# EasyEDA Pro project CoreBoard-001_2024-04-29.epro, schematic Schematic-CoreBoard-001

## Sheets
1 HLK-7688A: Create Date: 2024-04-11; Page Name: HLK-7688A; Project Name: CoreBoard-001; Schematic Name: Schematic-CoreBoard-001; Update Date: 2024-04-18; Company: 嘉立创EDA; Page Size: A4; Version: V1.0
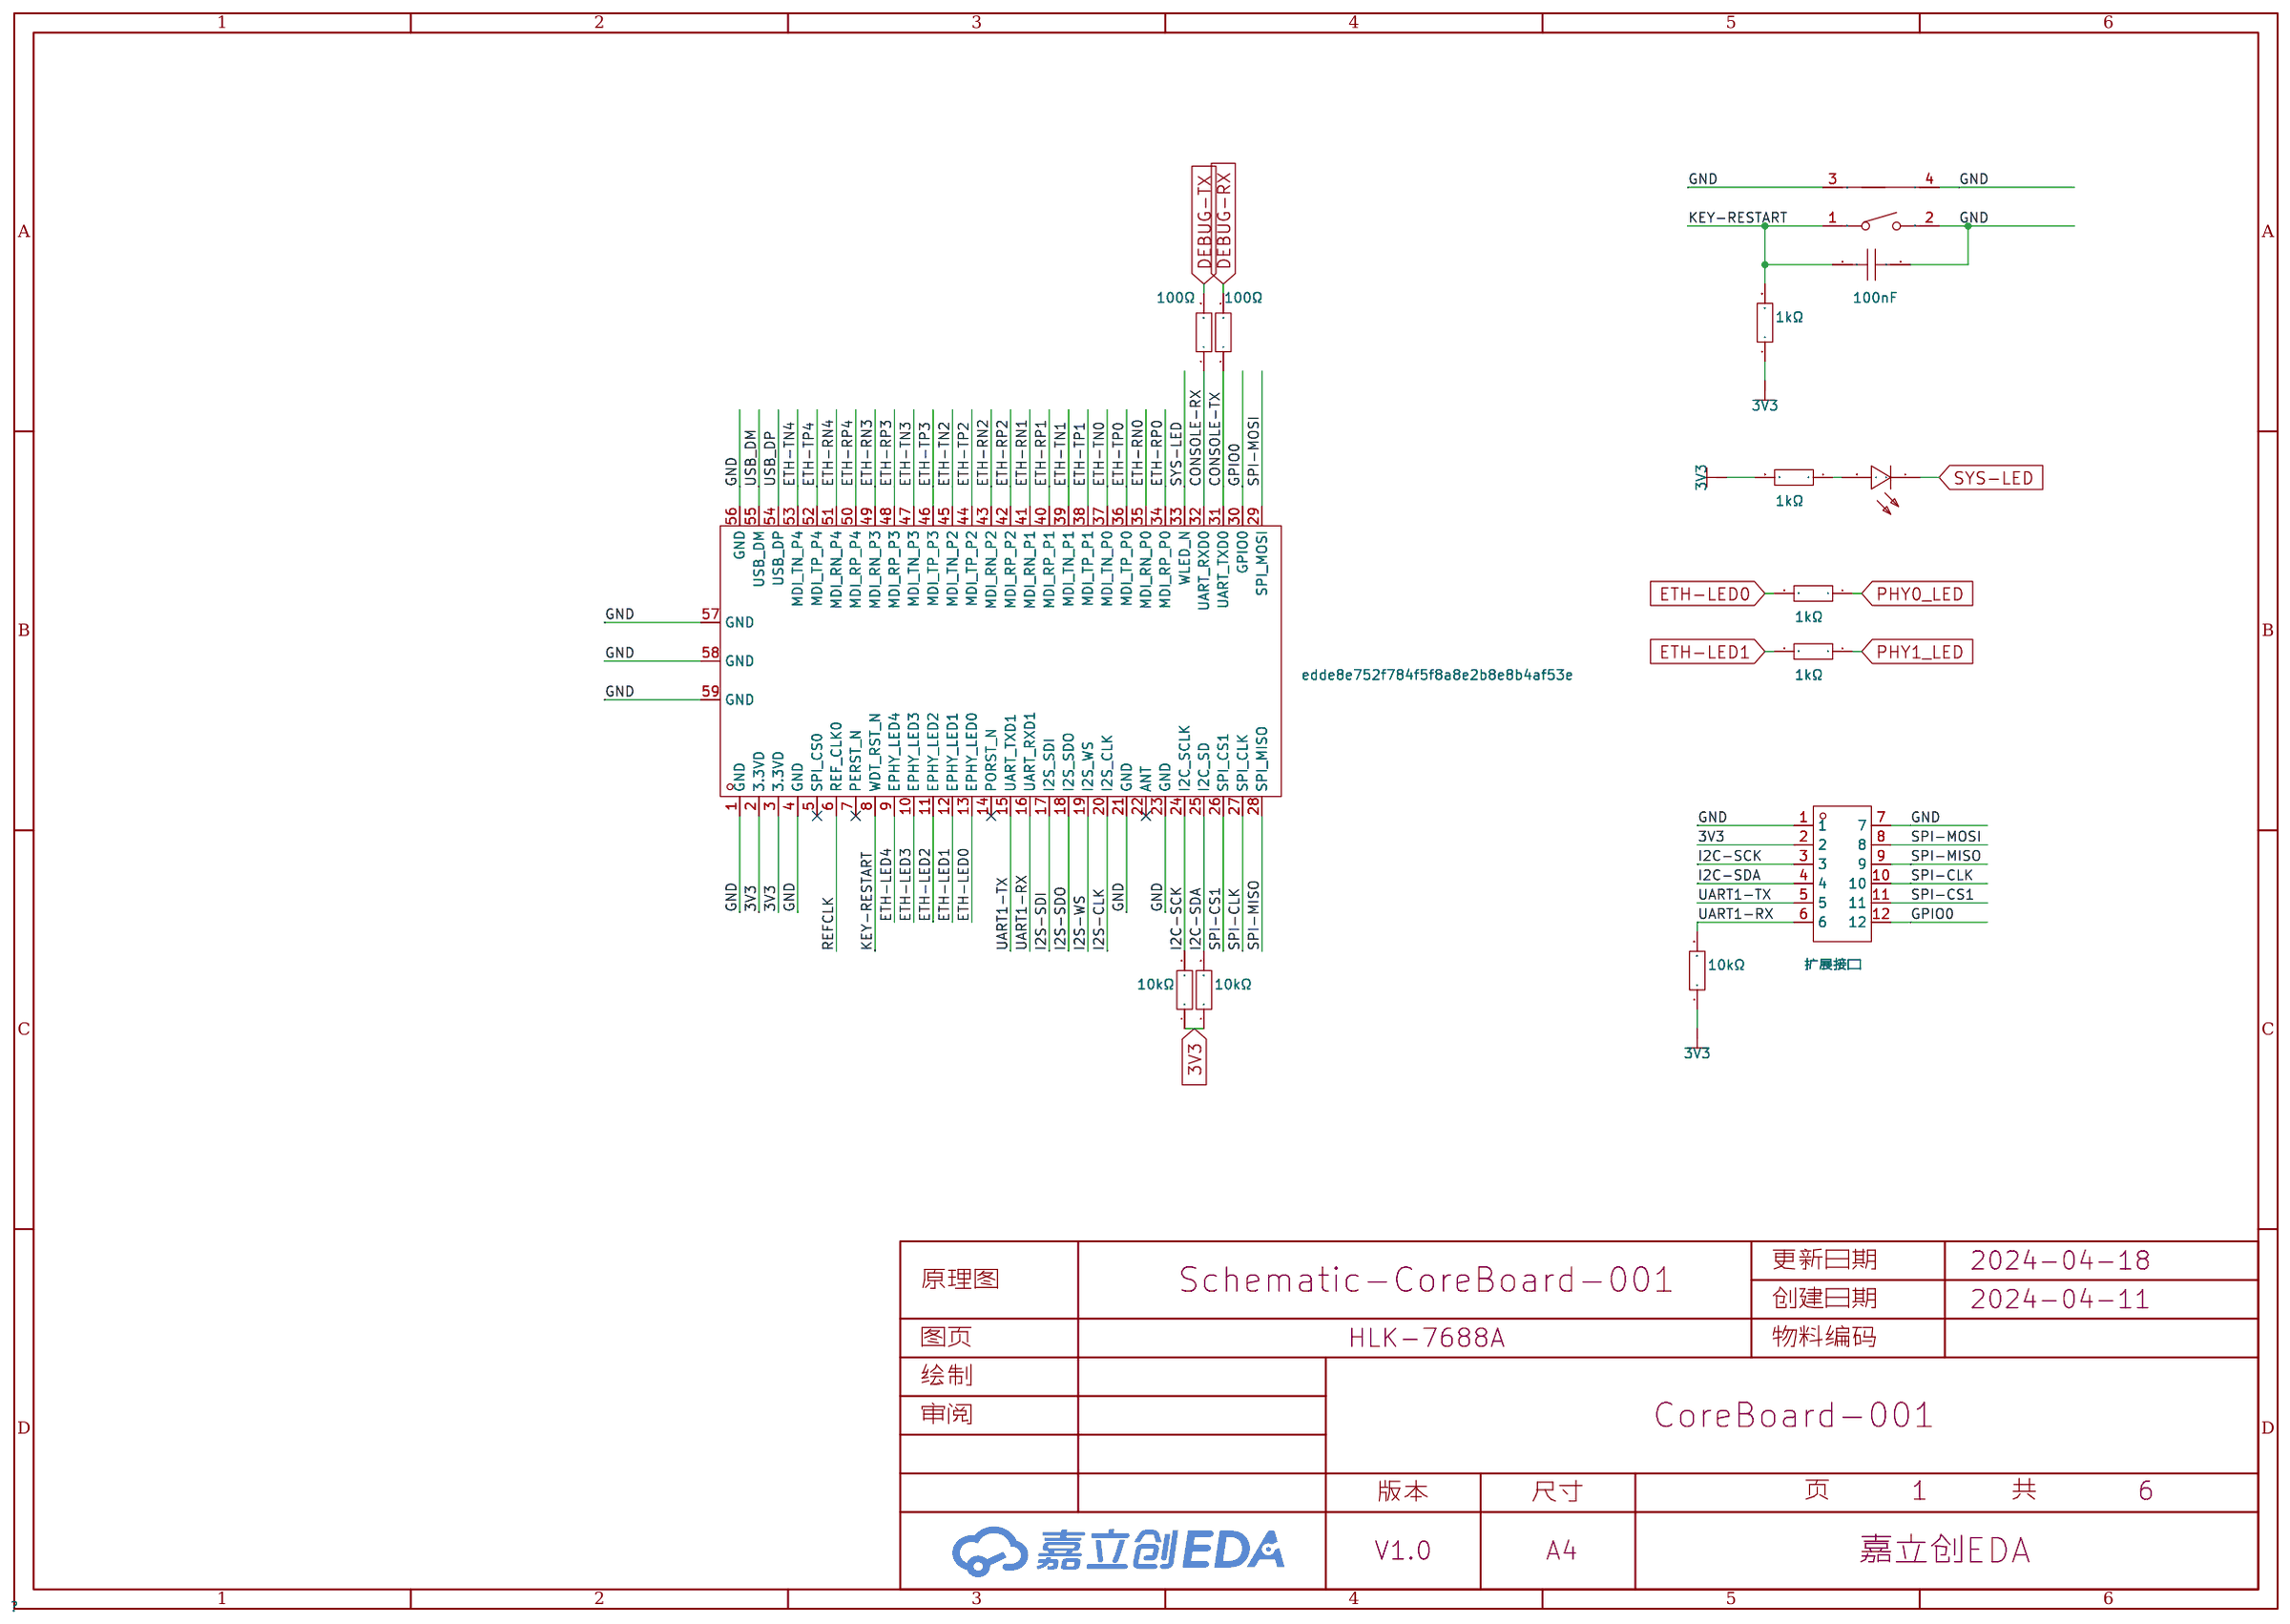
[diagram p0: HLK-7688A]
2 Power+CH340N: Page Name: Power+CH340N; Update Date: 2024-04-11
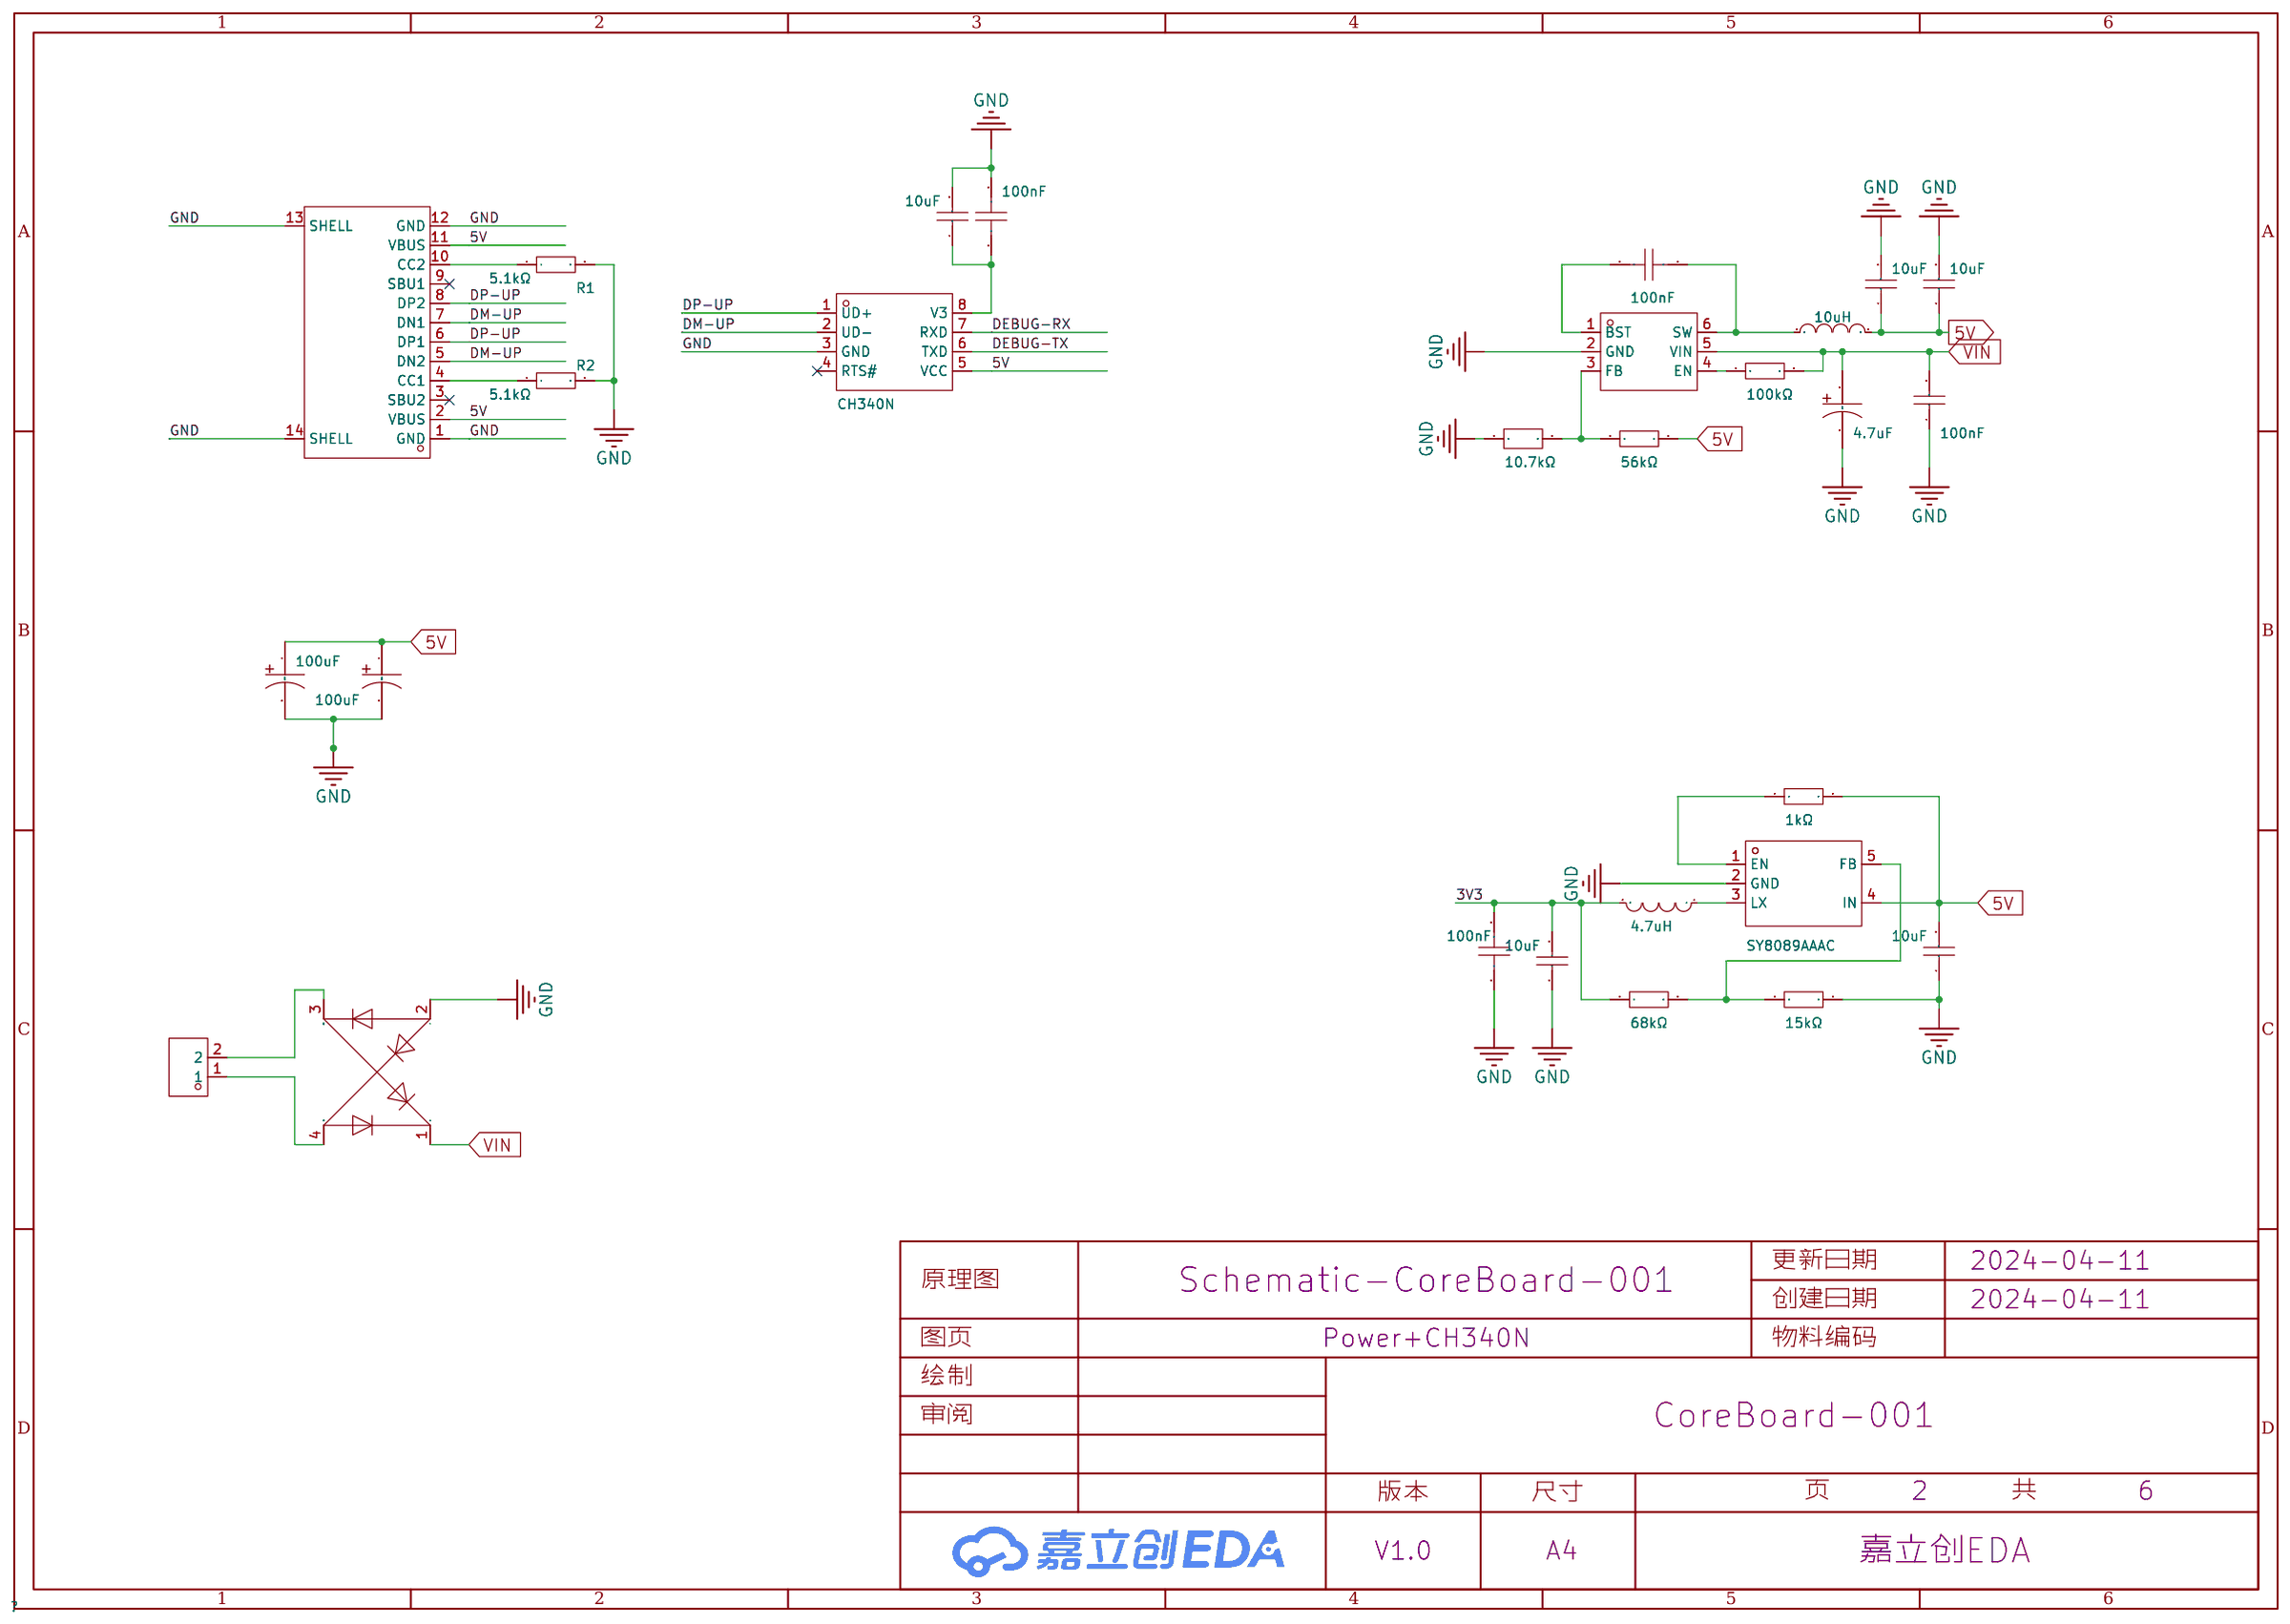
[diagram p1: Power+CH340N]
3 DS1307: Page Name: DS1307; Update Date: 2024-04-11
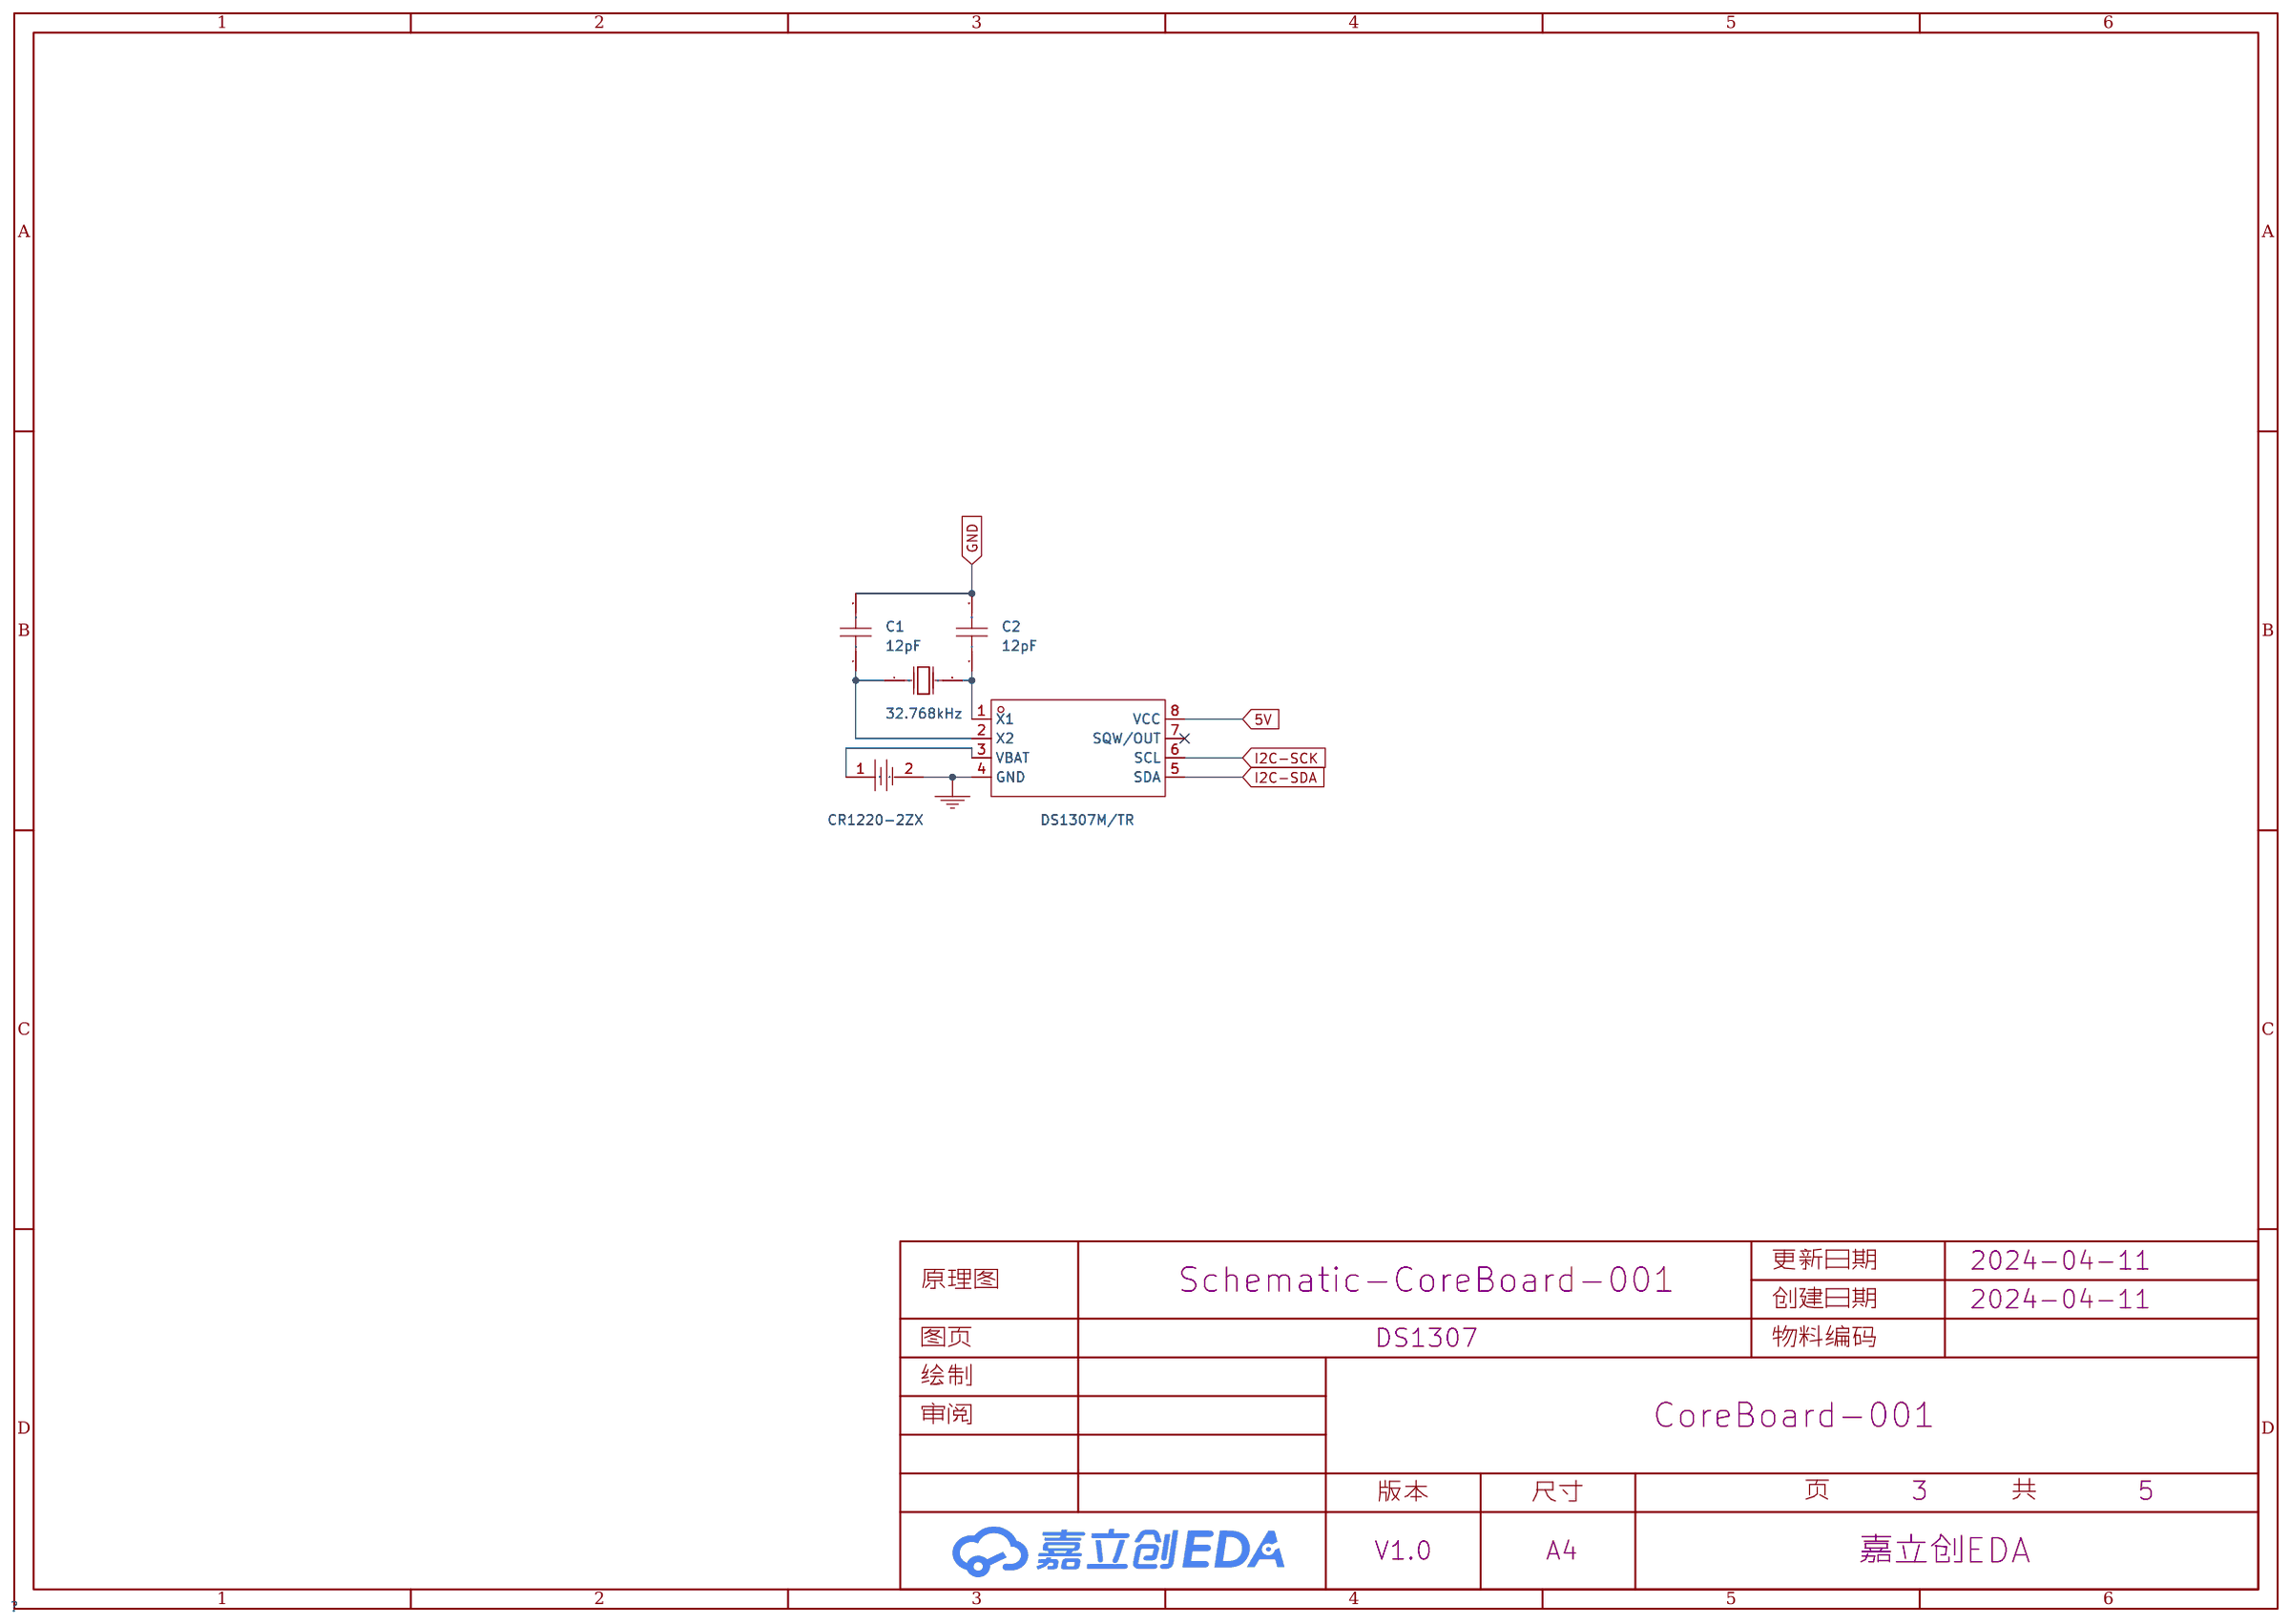
[diagram p2: DS1307]
4 USB: Page Name: USB; Update Date: 2024-04-11
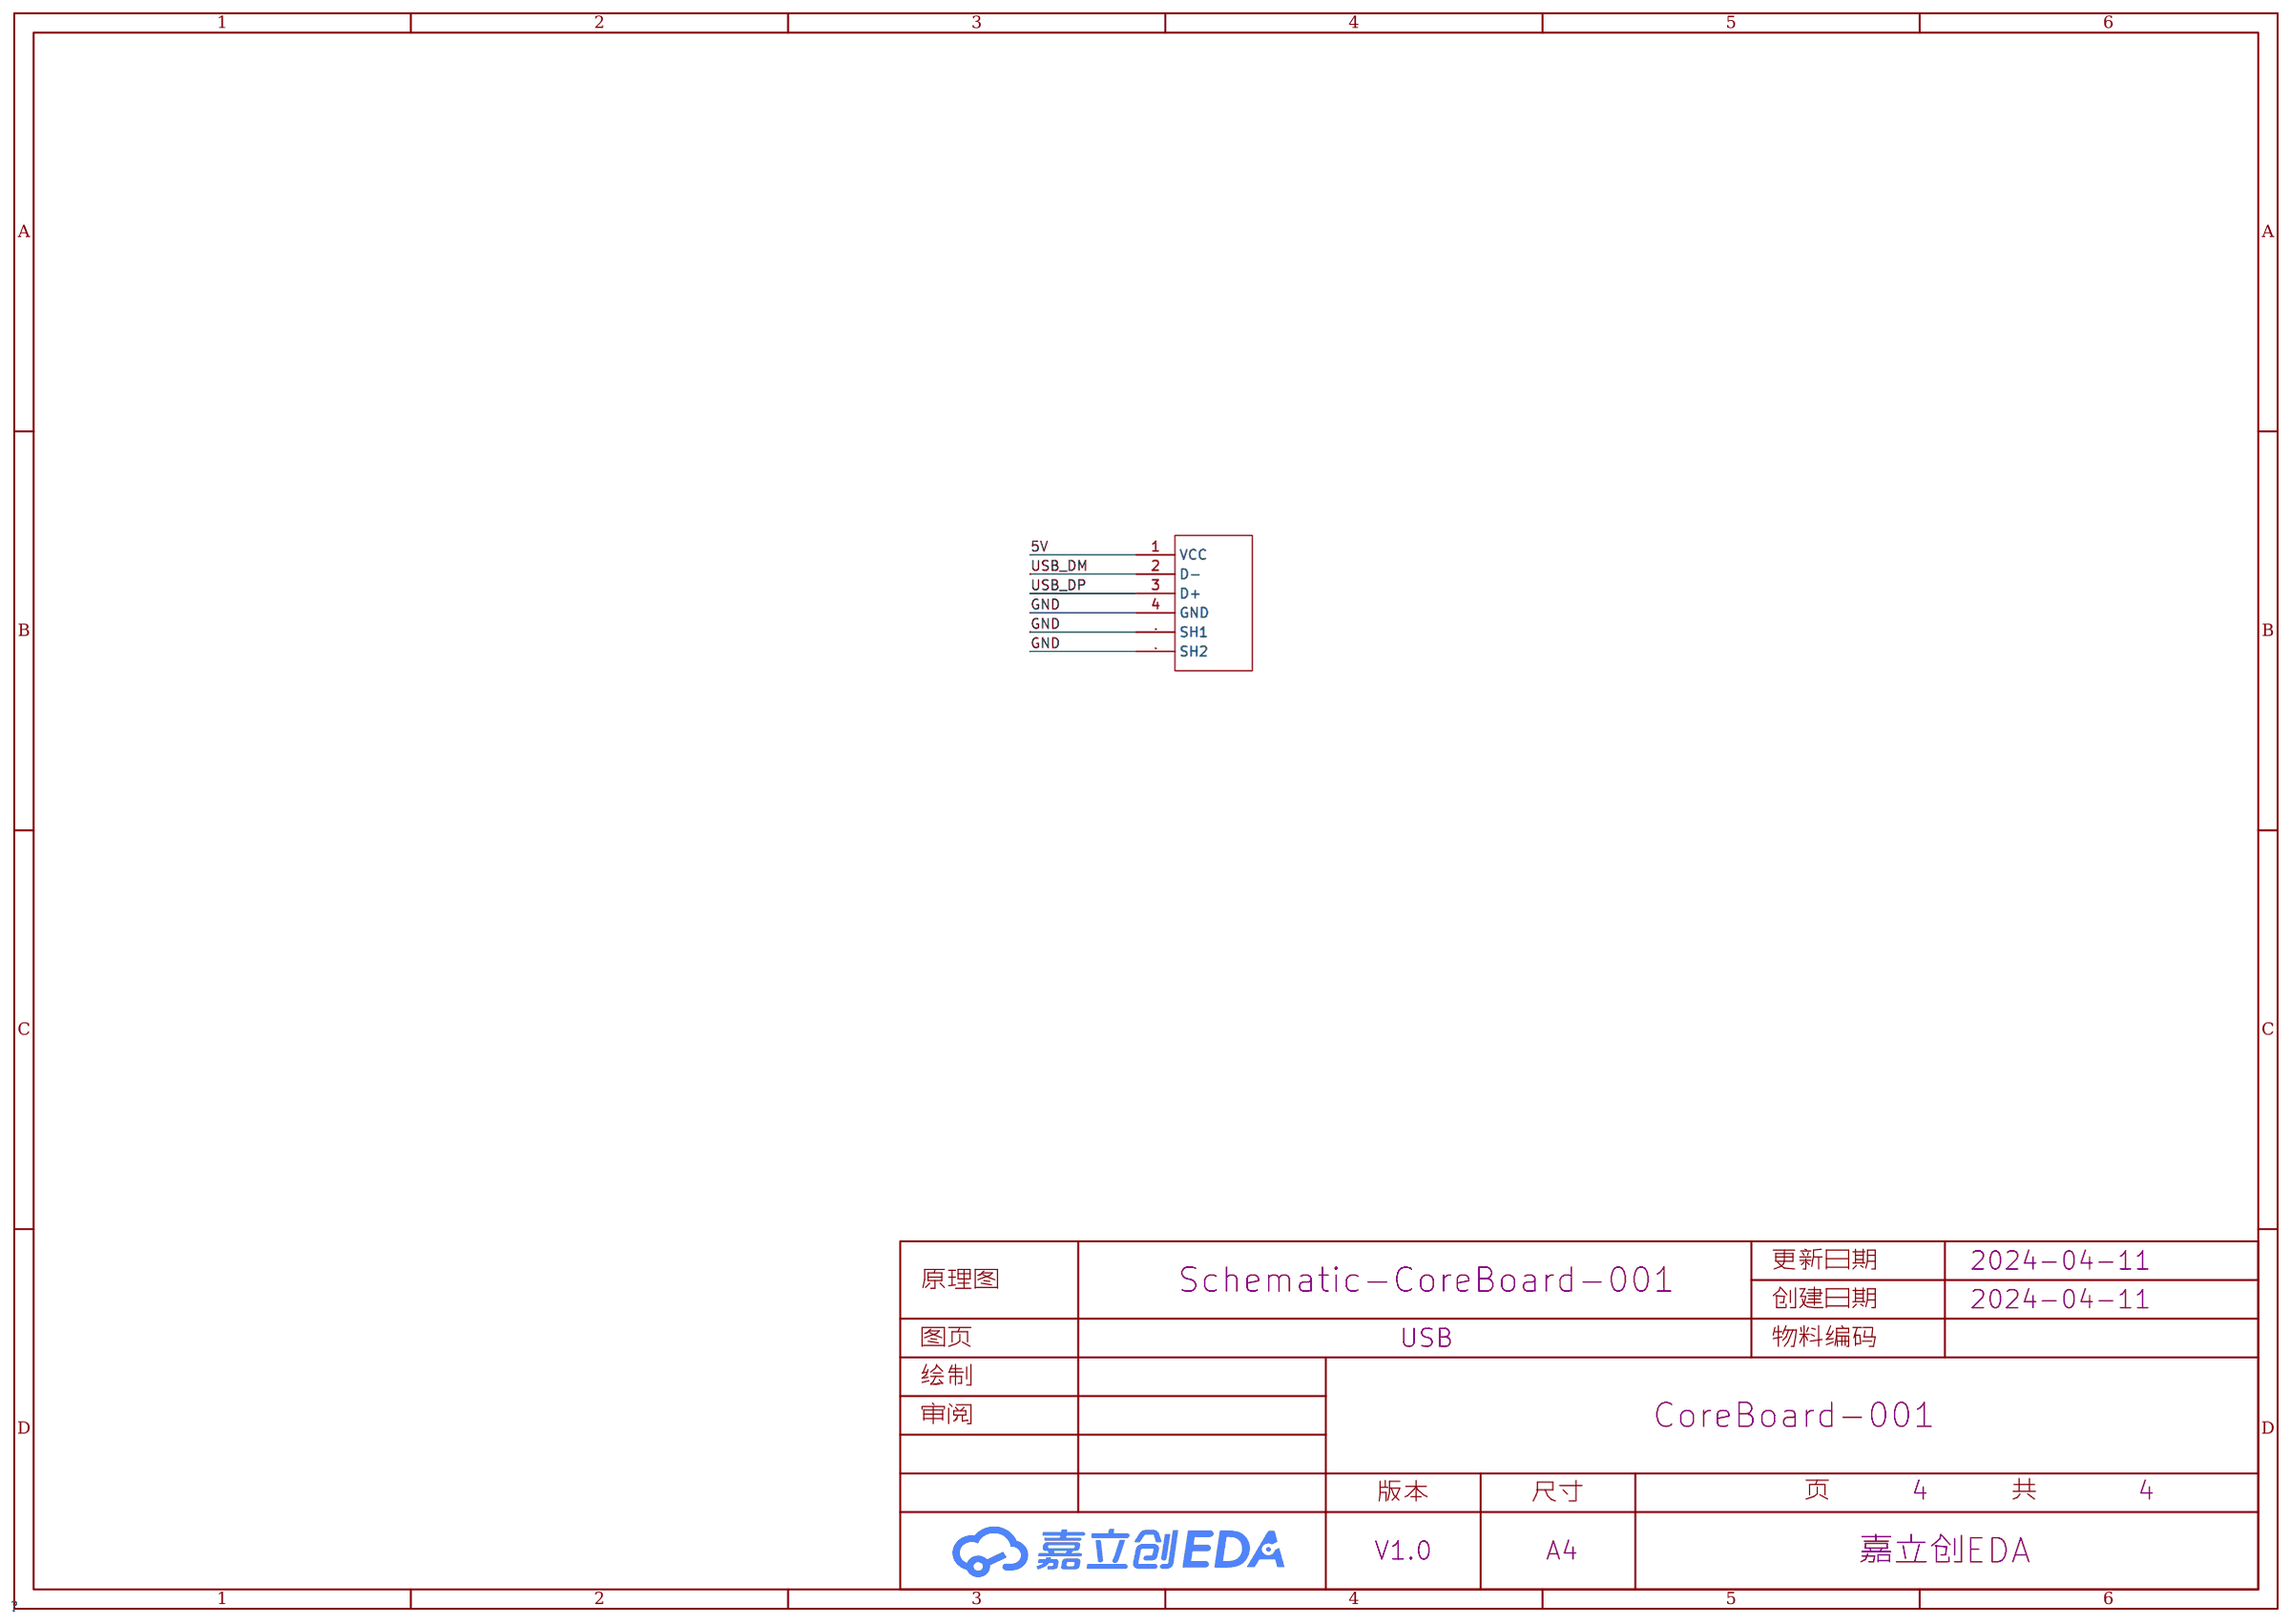
[diagram p3: USB]
5 ETH: Page Name: ETH
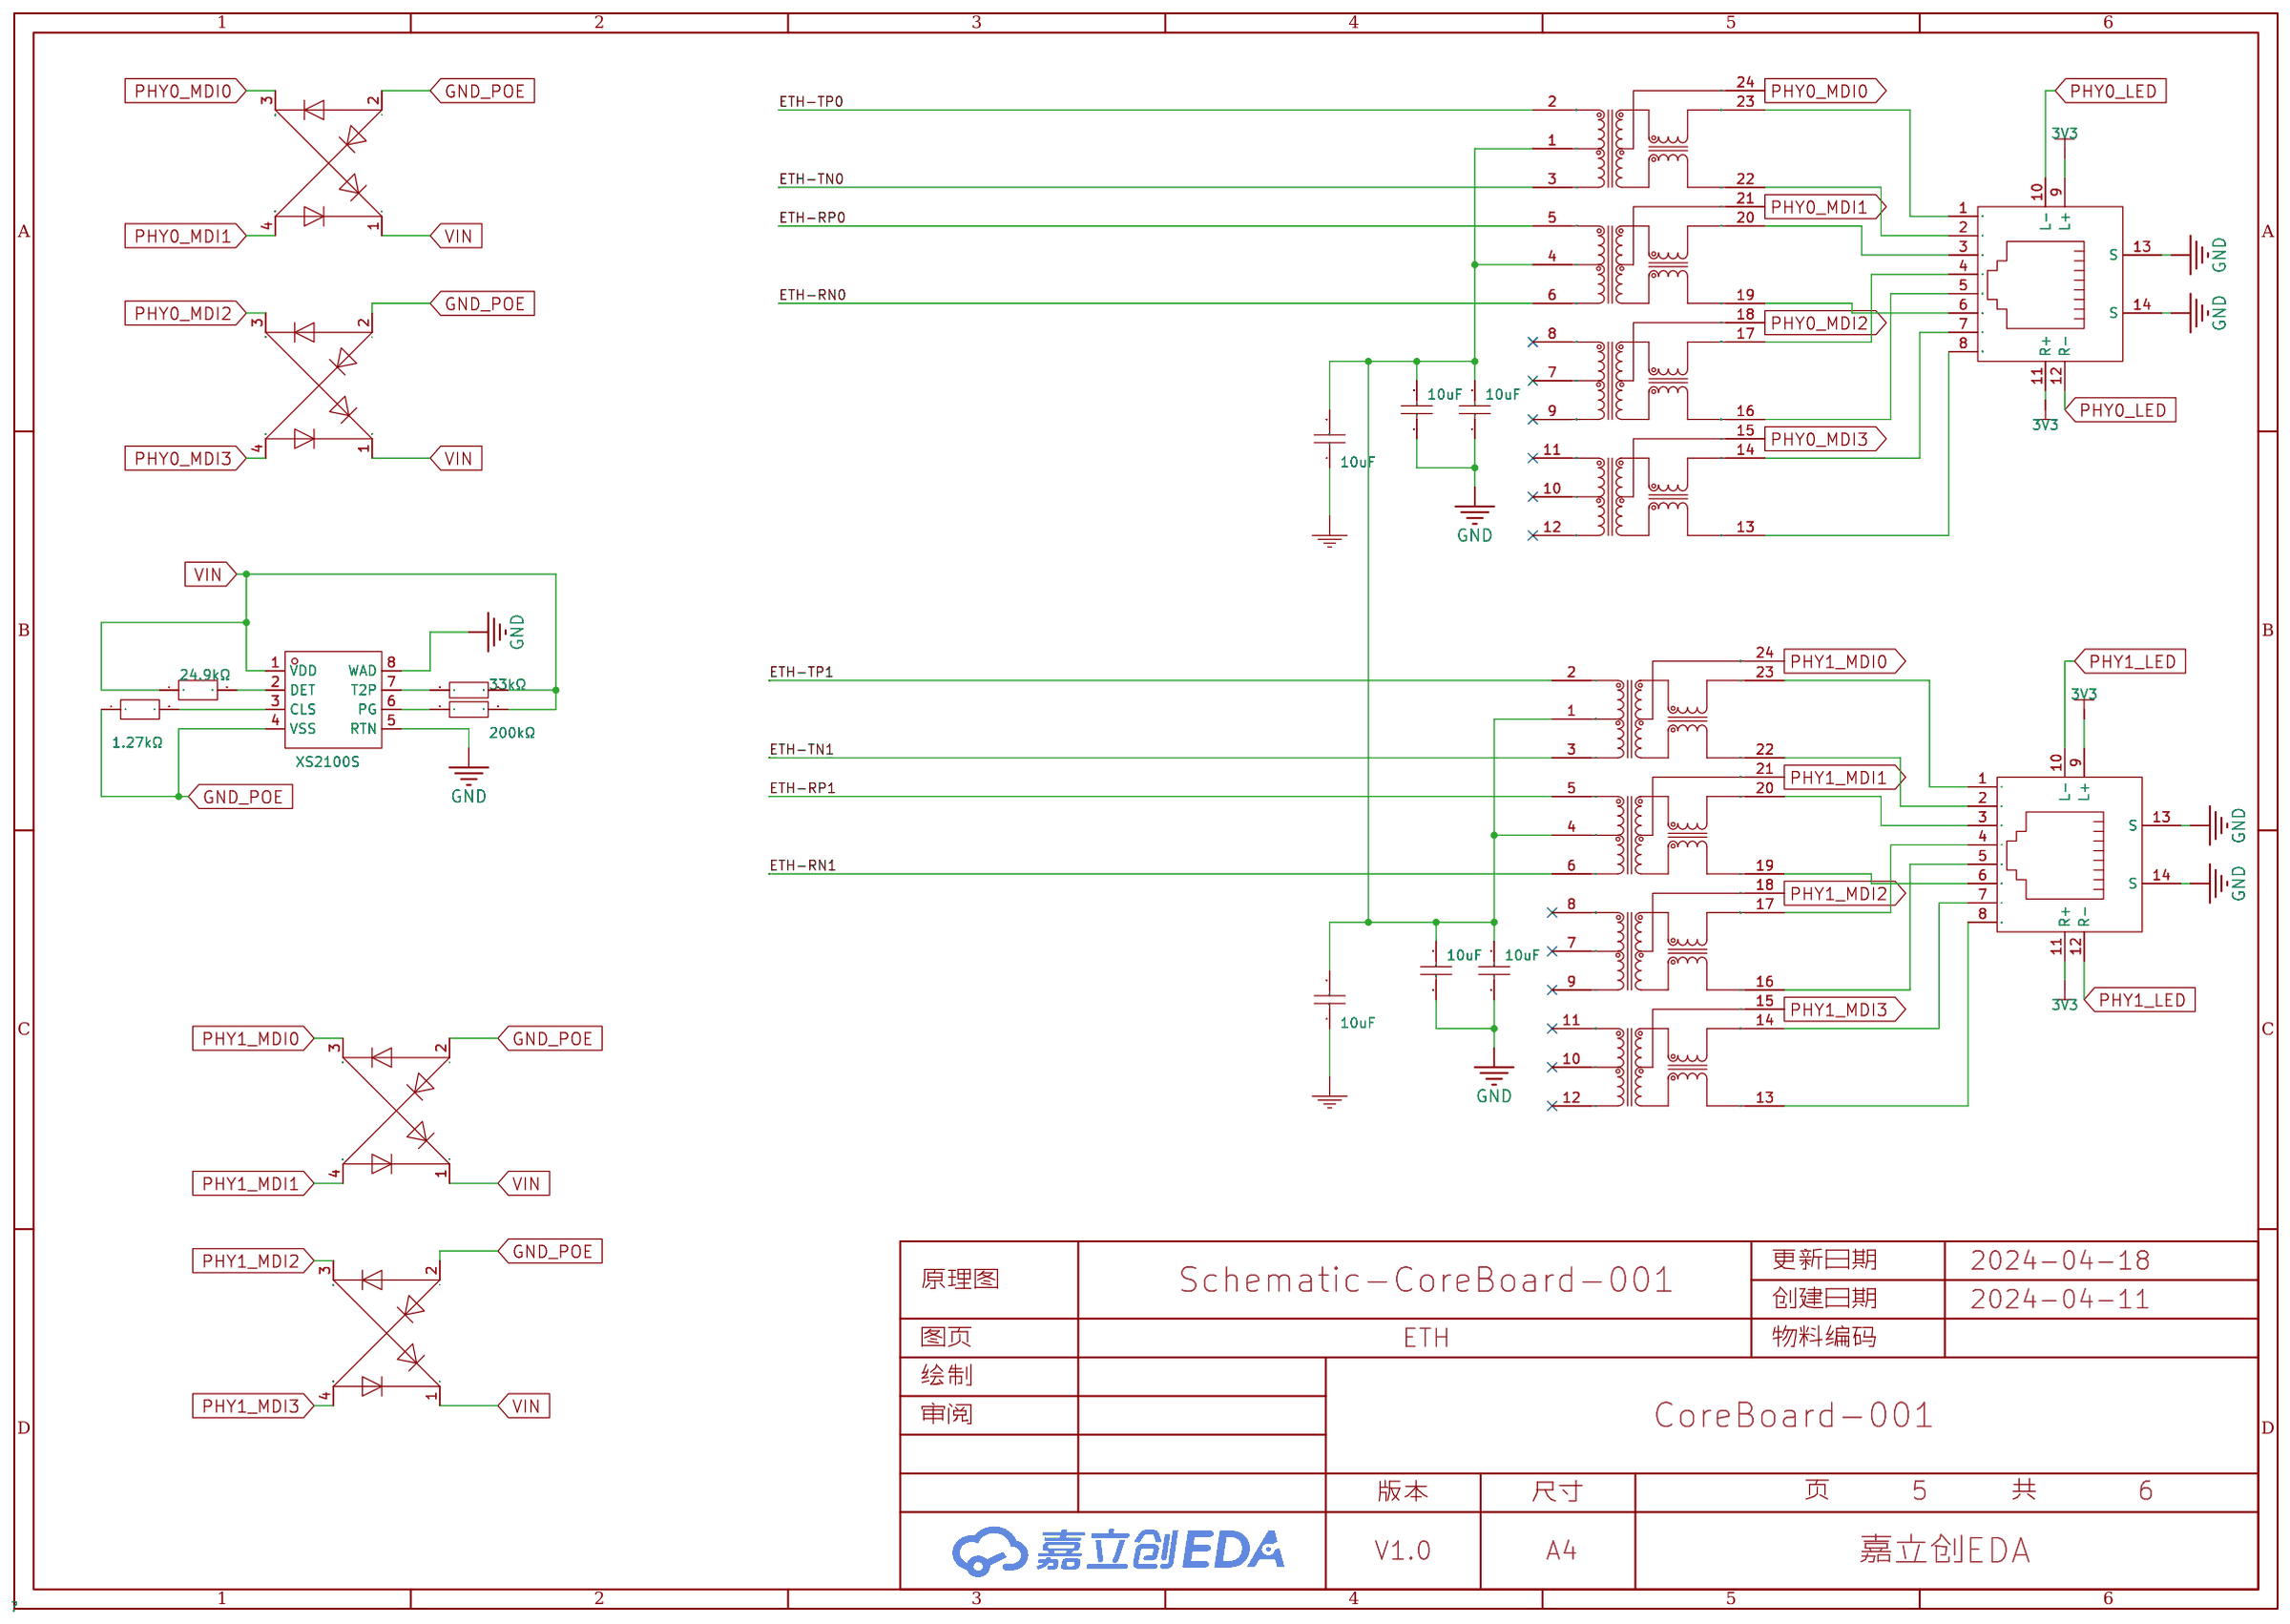
[diagram p4: ETH]
6 Audio: Create Date: 2024-04-12; Page Name: Audio; Update Date: 2024-04-19
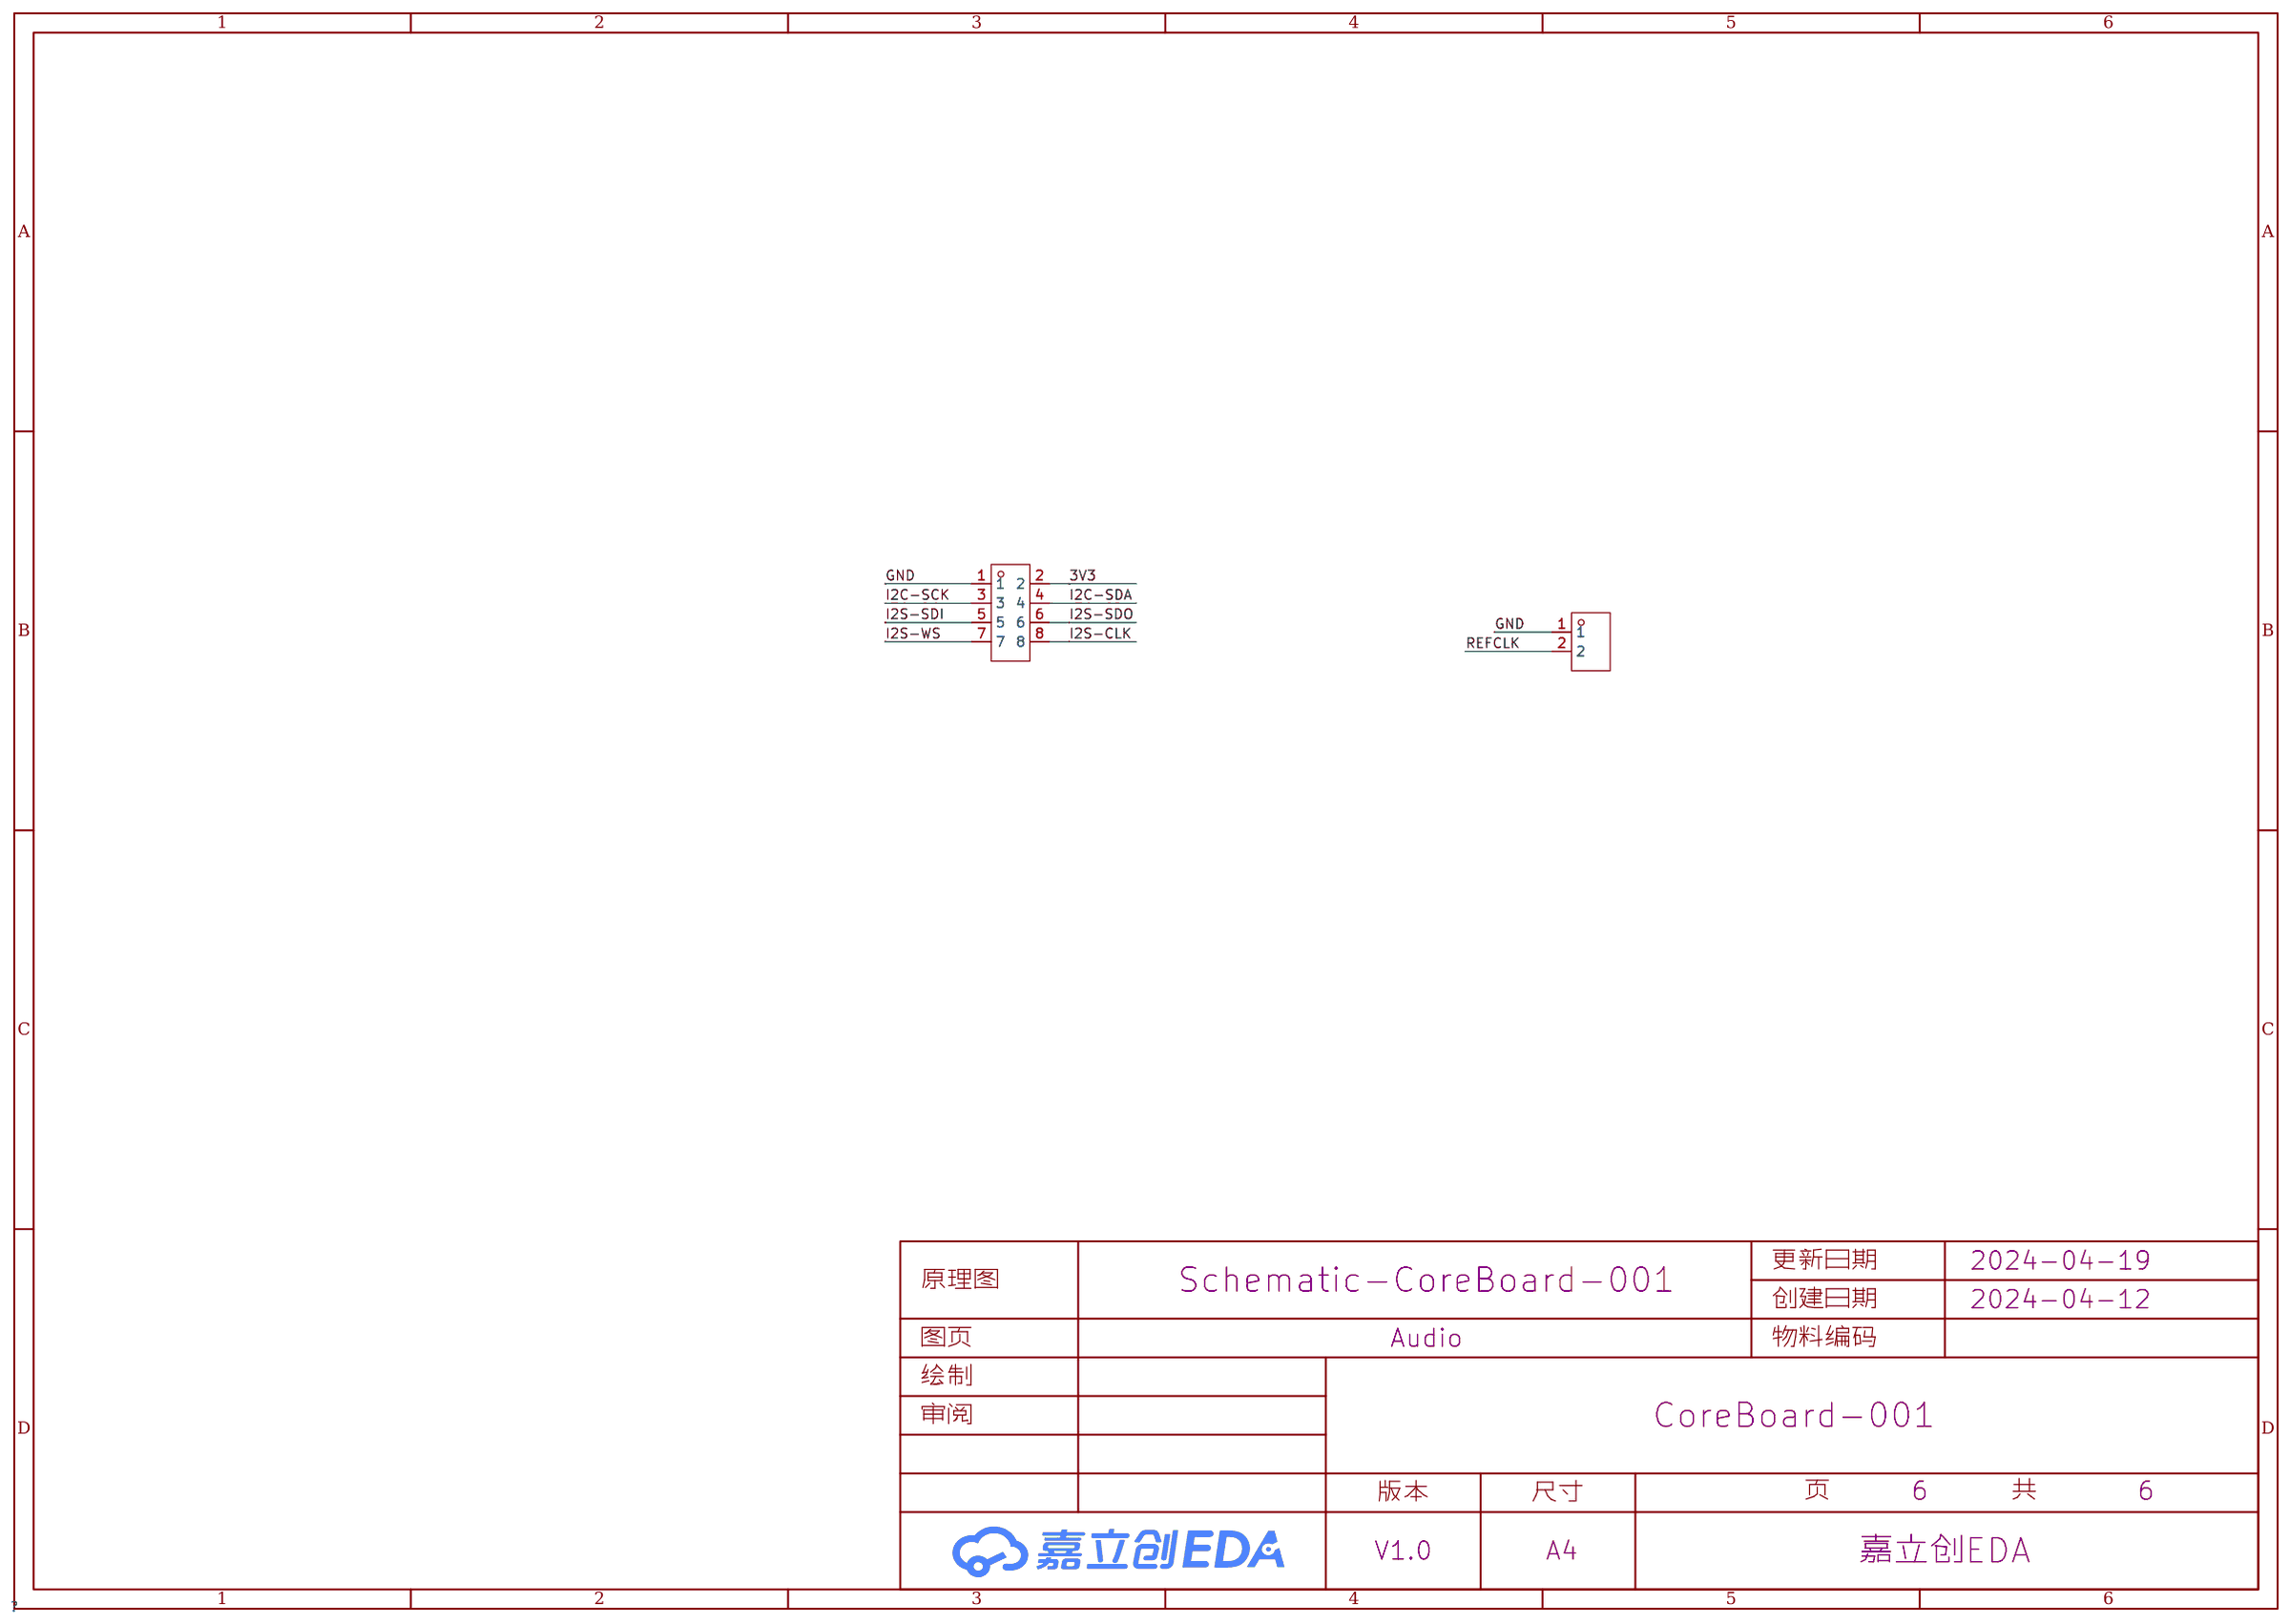
[diagram p5: Audio]

## Parts
sheet Audio
CN3  PH-2A  [CONN-TH_PH-2A_C2908623]
U12  HC-PHB2.0-2x4A  [CONN-TH_8P-P2.00_HC-PHB2.0-2X4A]
sheet DS1307
BT1  CR1220-2ZX  [BAT-SMD_CR1220-2ZX]
C1  12pF  [C0402]
C2  12pF  [C0402]
U2  DS1307M/TR  [SOP-8_L4.9-W3.9-P1.27-LS6.0-BL]
X1  32.768kHz  [OSC-TH_BD3.1-P0.8-D0.3]
sheet ETH
C9  10uF  [C0402]
C28  10uF  [C0402]
C29  10uF  [C0402]
C30  10uF  [C0402]
C31  10uF  [C0402]
C32  10uF  [C0402]
D2  MB10S  [MBS_L4.7-W3.8-P2.40-LS7.0-TL]
D3  MB10S  [MBS_L4.7-W3.8-P2.40-LS7.0-TL]
D4  MB10S  [MBS_L4.7-W3.8-P2.40-LS7.0-TL]
D5  MB10S  [MBS_L4.7-W3.8-P2.40-LS7.0-TL]
R7  24.9kΩ  [R0402]
R8  33kΩ  [R0402]
R9  200kΩ  [R0402]
RJ1  R-RJ45R08P-C000  [RJ45-TH_R-RJ45R08P-C000]
RJ2  R-RJ45R08P-C000  [RJ45-TH_R-RJ45R08P-C000]
U6  G2415S  [SMD-24_L15.1-W7.1-P1.00-LS10.0-BL]
U7  XS2100S  [SOP-8_L4.9-W3.9-P1.27-LS6.0-BL]
U8  G2415S  [SMD-24_L15.1-W7.1-P1.00-LS10.0-BL]
U9  1.27kΩ  [R0402]
sheet HLK-7688A
C26  100nF  [C0402]
CN2  扩展接口  [CONN-TH_12P-P2.00_HCTL_HC-PHD]
LED1  NCD0603R1  [LED0603-RD_RED]
R3  100Ω  [R0402]
R4  100Ω  [R0402]
R5  10kΩ  [R0402]
R6  10kΩ  [R0402]
R14  1kΩ  [R0402]
R15  1kΩ  [R0402]
R21  1kΩ  [R0402]
R22  1kΩ  [R0402]
R23  10kΩ  [R0402]
SW1  TS665ZJ  [SW-TH_TS665ZJ]
U1  2.412GHz；2.483GHz  [WIRELM-SMD_HLK-7688A]
sheet Power+CH340N
C15  10uF  [C0402]
C16  10uF  [C0402]
C17  100nF  [C0402]
C18  4.7uF  [CAP-SMD_BD4.0-L4.3-W4.3-FD-A]
C19  100nF  [C0603]
C20  10uF  [C0402]
C21  10uF  [C0402]
C22  100uF  [CAP-SMD_BD6.3-L6.6-W6.6-FD]
C23  100uF  [CAP-SMD_BD6.3-L6.6-W6.6-FD]
C24  100nF  [C0402]
C25  10uF  [C0402]
C27  100nF  [C0402]
CN1  DB2ERC-3.81-2P-GN  [CONN-TH_2P-P3.81_DB2ERC-3.81-2P]
D1  MB10S  [MBS_L4.7-W3.8-P2.40-LS7.0-TL]
L1  4.7uH  [IND-SMD_L4.0-W4.0]
L2  10uH  [IND-SMD_L4.4-W4.2]
R1  5.1kΩ  [R0402]
R2  5.1kΩ  [R0402]
R11  1kΩ  [R0402]
R12  68kΩ  [R0402]
R13  15kΩ  [R0402]
R18  100kΩ  [R0402]
R19  10.7kΩ  [R0402]
R20  56kΩ  [R0402]
U3  SY8089AAAC  [SOT-23-5_L3.0-W1.7-P0.95-LS2.8-BR]
U4  CH340N  [SOP-8_L4.9-W3.9-P1.27-LS6.0-BL]
U5  LGS5148  [SOT-23-6_L2.9-W1.6-P0.95-LS2.8-BL]
USB1  TYPE-C 16PIN 2MD(073)  [USB-C-SMD_TYPE-C-6PIN-2MD-073]
sheet USB
USB2  U-USBAR04P-F002  [USB-A-TH_USB-302-T]

## Library data of the parts
CN3 = PH-2A_C2908623: 插针结构:1x2P;间距:2mm;安装方式:直插;参考系列:PH;总PIN数:2P;排数:1;每排PIN数:2;行距:-;额定电流:2A;触头材质:黄铜;触头镀层:锡;工作温度范围:-20℃~+85℃;; LCSC Part Name: 1x2P 间距:2mm 直插 系列:PH; Supplier Part: C2908623; Manufacturer: HCTL(华灿天禄); Supplier Footprint: 插件,P=2mm; JLCPCB Part Class: 扩展库; Datasheet: https://atta.szlcsc.com/upload/public/pdf/source/20230707/BA576CECAD32FECA9ECBAF2430E681CE.pdf; Supplier: LCSC; Pins Structure: 1x2P; Pitch: 2mm; Mounting Style: 直插; Reference Series: PH; Number of Pins: 2P; Number of Rows: 1; Number of PINs Per Row: 2; Current Rating (Max): 2A; Contact Material: 黄铜; Contact Plating: 锡; Operating Temperature Range: -20℃~+85℃
U12 = HC-PHB2.0-2x4A: 插针结构:2x4P;间距:2mm;安装方式:直插;参考系列:PH;总PIN数:8P;排数:2;每排PIN数:4;额定电流:3A;触头材质:铜合金;触头镀层:锡;工作温度范围:-25℃~+85℃;; LCSC Part Name: 2x4P 间距:2mm 直插 系列:PH/HY; Supplier Part: C19273857; Manufacturer: HC(虹成电子); Supplier Footprint: 插件,P=2mm; Datasheet: https://atta.szlcsc.com/upload/public/pdf/source/20231201/0F2902E92AEB9EFD7A822D6EA0DCBEF3.pdf; Supplier: LCSC; Pins Structure: 2x4P; Pitch: 2mm; Mounting Style: 直插; Reference Series: PH; Number of Pins: 8P; Number of Rows: 2; Number of PINs Per Row: 4; Current Rating (Max): 3A; Contact Material: 铜合金; Contact Plating: 锡; Operating Temperature Range: -25℃~+85℃
BT1 = CR1220-2ZX: 连接器类型:电池底座;适用电池规格:CR1220;工作温度范围:-25℃~+85℃;; Supplier Part: C969906; Manufacturer: Q&J; Supplier Footprint: SMD; JLCPCB Part Class: 扩展库; Datasheet: https://atta.szlcsc.com/upload/public/pdf/source/20210107/C969906_C1D85B5C66CBBA4D1AEB8467FE1CEC7A.pdf; Supplier: LCSC; Connector Type: 电池底座; Battery Type: CR1220; Operating Temperature Range: -25℃~+85℃
C1 C2 = FN15N120J500PNG: 容值:12pF;精度:±5%;额定电压:50V;材质(温度系数):C0G;; LCSC Part Name: 12pF ±5% 50V; Supplier Part: C525199; Manufacturer: PSA(信昌电陶); Supplier Footprint: 0402; JLCPCB Part Class: 扩展库; Datasheet: https://atta.szlcsc.com/upload/public/pdf/source/20200506/C436246_4EAA78C9048D88437BAF2CB7B8BE45FD.pdf; Supplier: LCSC; Tolerance: ±5%; Voltage Rated: 50V; Temperature Coefficient: C0G
U2 = DS1307M/TR: Supplier Part: C356706; Manufacturer: HGSEMI(华冠); Supplier Footprint: SOP-8; JLCPCB Part Class: 扩展库; Datasheet: https://atta.szlcsc.com/upload/public/pdf/source/20190729/C356706_2772CBBEB0B8C4DD9579CF70ABC38E3B.pdf; Supplier: LCSC
X1 = TAXD32768K2CGDAZT2T: 晶振类型:直插晶振;频率:32.768kHz;常温频差:±20ppm;外接负载电容:12.5pF;; LCSC Part Name: 32.768kHz ±20ppm 12.5pF; Supplier Part: C145164; Manufacturer: YJX(雅晶鑫); Supplier Footprint: DT-38; JLCPCB Part Class: 扩展库; Datasheet: https://atta.szlcsc.com/upload/public/pdf/source/20171114/C145164_15106327013091117564.pdf; Supplier: LCSC; Crystal Type: 直插晶振; Normal temperature Frequency Tolerance: ±20ppm; External load capacitor: 12.5pF; Equivalent Series Resistance (ESR): 30kΩ; Operating Temperature: -20℃~+70℃
C9 C20 C21 C28-C32 = CL05A106MQ5NUNC: 容值:10uF;精度:±20%;额定电压:6.3V;材质(温度系数):X5R;; LCSC Part Name: 10uF ±20% 6.3V; Supplier Part: C15525; Manufacturer: SAMSUNG(三星); Supplier Footprint: 0402; JLCPCB Part Class: Basic Part; Datasheet: https://atta.szlcsc.com/upload/public/pdf/source/20220823/2B02EE04F8F211D38A52DCB16EB6BEBA.pdf; Supplier: LCSC; Tolerance: ±20%; Voltage Rated: 6.3V; Temperature Coefficient: X5R
D1-D5 = MB10S_C2488: 正向压降(Vf):1.1V@400mA;直流反向耐压(Vr):1kV;平均整流电流(Io):1A;正向浪涌电流(Ifsm):35A;; LCSC Part Name: 电压:1kV 电流:1A; Supplier Part: C2488; Manufacturer: MDD; Supplier Footprint: MBS; JLCPCB Part Class: Basic Part; Datasheet: https://atta.szlcsc.com/upload/public/pdf/source/20210506/C2487_3177A890C810790094D6606D0B30B249.pdf; Supplier: LCSC; Forward Voltage (Vf@If): 1.1V@400mA; Reverse Voltage (Vr): 1kV; Average Rectified Current (Io): 1A; Reverse Leakage Current (Ir): 5uA@1kV; Peak Forward Surge Current: 35A; Operating Temperature: -55℃~+150℃@(Tj)
R7 = ERJ2RKF2492X: 电阻类型:厚膜电阻;阻值:24.9kΩ;精度:±1%;功率:100mW;最大工作电压:-;温度系数:±100ppm/℃;; LCSC Part Name: 24.9kΩ ±1% 100mW 厚膜电阻; Supplier Part: C409904; Manufacturer: PANASONIC(松下); Supplier Footprint: 0402; JLCPCB Part Class: 扩展库; Datasheet: https://atta.szlcsc.com/upload/public/pdf/source/20190806/C409904_88C5E53F20CD19C8E4FD2CDAC0C831B2.pdf; Supplier: LCSC; Type: 厚膜电阻; Tolerance: ±1%; Power(Watts): 100mW; Temperature Coefficient: ±100ppm/℃; Operating Temperature Range: -55℃~+155℃
R8 = 0402WGF3302TCE: 阻值:33kΩ;精度:±1%;功率:62.5mW;温度系数:±100ppm/℃;电阻类型:厚膜电阻;; LCSC Part Name: 33kΩ ±1% 62.5mW 厚膜电阻; Supplier Part: C25779; Manufacturer: UNI-ROYAL(厚声); Supplier Footprint: 0402; JLCPCB Part Class: Basic Part; Datasheet: https://atta.szlcsc.com/upload/public/pdf/source/20200306/C422600_1E6D84923E4A46A82E41ADD87F860B5C.pdf; Supplier: LCSC; Tolerance: ±1%; Power(Watts): 62.5mW; Overload Voltage (Max): 50V; Temperature Coefficient: ±100ppm/℃; Type: 厚膜电阻; Operating Temperature Range: -55℃~+155℃
R9 = 0402WGF2003TCE: 电阻类型:厚膜电阻;阻值:200kΩ;精度:±1%;功率:62.5mW;最大工作电压:50V;温度系数:±100ppm/℃;; LCSC Part Name: 200kΩ ±1% 62.5mW 厚膜电阻; Supplier Part: C25764; Manufacturer: UNI-ROYAL(厚声); Supplier Footprint: 0402; JLCPCB Part Class: 基础库; Datasheet: https://atta.szlcsc.com/upload/public/pdf/source/20200306/C422600_1E6D84923E4A46A82E41ADD87F860B5C.pdf; Supplier: LCSC; Type: 厚膜电阻; Tolerance: ±1%; Power(Watts): 62.5mW; Overload Voltage (Max): 50V; Temperature Coefficient: ±100ppm/℃; Operating Temperature Range: -55℃~+155℃
RJ1 RJ2 = R-RJ45R08P-C000: 连接器类型:RJ插座;USOC代码:RJ45;端口数量:1;等级:-;安装方式:弯插;屏蔽:有屏蔽;LED:带LED;工作温度范围:0℃~+70℃;; LCSC Part Name: RJ45 弯插 带LED 8P/8C 铜壳带屏蔽 短体  无弹片; Supplier Part: C386757; Manufacturer: Ckmtw(灿科盟); Supplier Footprint: 插件; JLCPCB Part Class: 扩展库; Datasheet: https://atta.szlcsc.com/upload/public/pdf/source/20190508/C386757_590BCC8A33AAEEF7838490D656B2E4CF.pdf; Supplier: LCSC; Connector Type: RJ插座; USOC Codes: RJ45; Number of Ports: 1; Mounting Style: 弯插; Shielding: 有屏蔽; LED: 带LED; Operating Temperature Range: 0℃~+70℃
U6 U8 = G2415S: 端口:单口;功能(POE或非POE):POE;线圈组数:4;速率:1000M;; LCSC Part Name: 单口千兆网络隔离变压器; Supplier Part: C3003219; Manufacturer: CND-tek(磁联达); Supplier Footprint: SMD-24P; JLCPCB Part Class: 扩展库; Datasheet: https://atta.szlcsc.com/upload/public/pdf/source/20220510/C1CE9EC60FECC6A4341BD8E6D8D6B072.pdf; Supplier: LCSC; port: 单口; HI-POT( Vrms ): 1.5kV; function: POE; Turns Ratio: 1:1; Number of Loop: 4; rate: 1000M; operating temperature: -40℃~+85℃; CWW( pF Max ): 28pF; LL(K)( uH Max ): 0.5uH; DCR( Ω Max ): 0.9Ω; Insertion Loss ( dB Max ): -1dB
U7 = XS2100S: LCSC Part Name: IEEE 802.3af/at 兼容 用电设备接口控制器集成功率MOSFET; Supplier Part: C2890398; Manufacturer: chipup(芯昇); Supplier Footprint: SOP-8; JLCPCB Part Class: 扩展库; Datasheet: https://atta.szlcsc.com/upload/public/pdf/source/20210902/41A577B37AB5680977B67D37149DBEA0.pdf; Supplier: LCSC
U9 = FRC0402F1271TS: 电阻类型:厚膜电阻;阻值:1.27kΩ;精度:±1%;功率:62.5mW;最大工作电压:50V;温度系数:±100ppm/℃;; LCSC Part Name: 1.27kΩ ±1% 62.5mW 厚膜电阻; Supplier Part: C3013151; Manufacturer: FOJAN(富捷); Supplier Footprint: 0402; JLCPCB Part Class: 扩展库; Datasheet: https://atta.szlcsc.com/upload/public/pdf/source/20211221/925EC7D7225764EE0046F22065062C87.pdf; Supplier: LCSC; Type: 厚膜电阻; Tolerance: ±1%; Power(Watts): 62.5mW; Overload Voltage (Max): 50V; Temperature Coefficient: ±100ppm/℃
C17 C24 C26 C27 = CC0402KRX7R7BB104: 容值:100nF;精度:±10%;额定电压:16V;材质(温度系数):X7R;; LCSC Part Name: 100nF ±10% 16V; Supplier Part: C60474; Manufacturer: YAGEO(国巨); Supplier Footprint: 0402; JLCPCB Part Class: Extended Part; Datasheet: https://atta.szlcsc.com/upload/public/pdf/source/20211223/9278FD768280B81DDBEF48FA36411A03.pdf; Supplier: LCSC; Tolerance: ±10%; Voltage Rated: 16V; Temperature Coefficient: X7R
CN2 = HC-PHD-2*6A: 插针结构:2x6P;间距:2mm;安装方式:直插;参考系列:PHD;总PIN数:12P;排数:2;每排PIN数:6;行距:2mm;额定电流:3A;触头材质:黄铜;触头镀层:锡;工作温度范围:-25℃~+85℃;; LCSC Part Name: 2x6P 间距:2mm 直插 系列:PHD; Supplier Part: C2845617; Manufacturer: HCTL(华灿天禄); Supplier Footprint: 插件,P=2mm; JLCPCB Part Class: 扩展库; Datasheet: https://atta.szlcsc.com/upload/public/pdf/source/20230711/213B911570049296A4498848D3074BCF.pdf; Supplier: LCSC; Pins Structure: 2x6P; Pitch: 2mm; Mounting Style: 直插; Reference Series: PHD; Number of Pins: 12P; Number of Rows: 2; Number of PINs Per Row: 6; Row Spacing: 2mm; Current Rating (Max): 3A; Contact Material: 黄铜; Contact Plating: 锡; Operating Temperature Range: -25℃~+85℃
LED1 = NCD0603R1_C84263: 灯头类型:-;发光颜色:红色;正向电压(VF):1.6V~2.6V;功率:65mW;正向电流:20mA;主波长:615nm~630nm;二极管配置:独立二极管;透镜颜色:无色透明透镜;色温:-;发光强度:80mcd~220mcd;发光角度:130°;载带方式:-;工作温度:-30℃~+85℃;; Supplier Part: C84263; Manufacturer: 国星光电; Supplier Footprint: 0603; JLCPCB Part Class: 扩展库; Datasheet: https://atta.szlcsc.com/upload/public/pdf/source/20200820/C84263_DABC6A75E58F576973B407FDBA283D60.pdf; Supplier: LCSC; Emitted Color: 红色; Forward Voltage (VF): 1.6V~2.6V; Power Dissipation: 65mW; Forward Current: 20mA; Dominant Wavelength: 615nm~630nm; Diode Configuration: 独立二极管; Lens Color: 无色透明透镜; Luminous Intensity: 80mcd~220mcd; Viewing Angle: 130°; Operating Temperature: -30℃~+85℃
R3 R4 = 0402WGF1000TCE: 电阻类型:厚膜电阻;阻值:100Ω;精度:±1%;功率:62.5mW;最大工作电压:50V;温度系数:±200ppm/℃;; LCSC Part Name: 100Ω ±1% 62.5mW 厚膜电阻; Supplier Part: C25076; Manufacturer: UNI-ROYAL(厚声); Supplier Footprint: 0402; JLCPCB Part Class: Basic Part; Datasheet: https://atta.szlcsc.com/upload/public/pdf/source/20200306/C422600_1E6D84923E4A46A82E41ADD87F860B5C.pdf; Supplier: LCSC; Type: 厚膜电阻; Tolerance: ±1%; Power(Watts): 62.5mW; Overload Voltage (Max): 50V; Temperature Coefficient: ±200ppm/℃; Operating Temperature Range: -55℃~+155℃
R5 R6 R23 = RC0402FR-0710KL: 电阻类型:厚膜电阻;阻值:10kΩ;精度:±1%;功率:62.5mW;最大工作电压:50V;温度系数:±100ppm/℃;; LCSC Part Name: 厚膜电阻 10kΩ ±1% 62.5mW; Supplier Part: C60490; Manufacturer: YAGEO(国巨); Supplier Footprint: 0402; JLCPCB Part Class: 扩展库; Datasheet: https://atta.szlcsc.com/upload/public/pdf/source/20170925/C131467_1506321478108990263.pdf; Supplier: LCSC; Type: 厚膜电阻; Tolerance: ±1%; Power(Watts): 62.5mW; Overload Voltage (Max): 50V; Temperature Coefficient: ±100ppm/℃; Operating Temperature Range: -55℃~+155℃
R11 R14 R15 R21 R22 = 0402WGF1001TCE: 阻值:1kΩ;精度:±1%;功率:62.5mW;温度系数:±100ppm/℃;电阻类型:厚膜电阻;; LCSC Part Name: 1kΩ ±1% 62.5mW 厚膜电阻; Supplier Part: C11702; Manufacturer: UNI-ROYAL(厚声); Supplier Footprint: 0402; JLCPCB Part Class: 基础库; Datasheet: https://atta.szlcsc.com/upload/public/pdf/source/20200306/C422600_1E6D84923E4A46A82E41ADD87F860B5C.pdf; Supplier: LCSC; Tolerance: ±1%; Power(Watts): 62.5mW; Overload Voltage (Max): 50V; Temperature Coefficient: ±100ppm/℃; Type: 厚膜电阻; Operating Temperature Range: -55℃~+155℃
SW1 = TS665ZJ: 电路结构:单刀单掷;按钮形状:圆形按钮;作用力:250gf;安装方式:卧插;开关长度:6.2mm;开关宽度:6.2mm;开关高度:5mm;带支架:带支架;触点电流:50mA;额定电压(DC):12V;绝缘电阻:100MΩ;机械寿命:5万次;; LCSC Part Name: 6.2*6.2*5mm 卧插 轻触开关; Supplier Part: C557599; Manufacturer: SHOU HAN(首韩); Supplier Footprint: 插件; JLCPCB Part Class: 扩展库; Datasheet: https://atta.szlcsc.com/upload/public/pdf/source/20200519/C557599_C93058E34E1879225DC935A3AAEF7EAA.pdf; Supplier: LCSC; Circuit: 单刀单掷; Actuator Style: 圆形按钮; Operating Force: 250gf; Mounting Style: 卧插; Switch Length: 6.2mm; Switch Width: 6.2mm; Switch Height: 5mm; Strike Gundam: 带支架; Contact Current: 50mA; Voltage Rating (DC): 12V; Insulation Resistance: 100MΩ; Actuator/Cap Color: 黑色; Pin Style: PC引脚; Mechanical Life: 5万次
U1 = HLK-7688A: 核心处理器:MT7688AN芯片;频率:2.412GHz；2.483GHz;天线形式:-;发射功率:14dBm~22dBm;接收灵敏度:-;; LCSC Part Name: 网口路由WIFI模块 天线配件HLK-TX-PCB-B; Supplier Part: C209919; Manufacturer: HI-LINK(海凌科); JLCPCB Part Class: 扩展库; Datasheet: https://atta.szlcsc.com/upload/public/pdf/source/20190724/C209919_D38DEFE07EEC6459837A9CD0457A8361.pdf; Supplier: LCSC; Core Processor: MT7688AN芯片; Support Interface: UART\USB\SPI\PWM\I2C; Output Power: 14dBm~22dBm; Operating Voltage: 3.3V; Operating Temperature: -20℃~+60℃
C15 C16 C25 = CL05A106MQ5NUNC: 容值:10uF;精度:±20%;额定电压:6.3V;材质(温度系数):X5R;; LCSC Part Name: 10uF ±20% 6.3V; Supplier Part: C15525; Manufacturer: SAMSUNG(三星); Supplier Footprint: 0402; JLCPCB Part Class: 基础库; Datasheet: https://atta.szlcsc.com/upload/public/pdf/source/20220823/2B02EE04F8F211D38A52DCB16EB6BEBA.pdf; Supplier: LCSC; Tolerance: ±20%; Voltage Rated: 6.3V; Temperature Coefficient: X5R
C18 = VT1H4R7M0405: 容值:4.7uF;精度:±20%;额定电压:50V;纹波电流:14mA@120Hz;等效串联电阻:-;; LCSC Part Name: 4.7uF ±20% 50V; Supplier Part: C213488; Manufacturer: ROQANG(容强); Supplier Footprint: SMD,D4xL5.4mm; JLCPCB Part Class: Extended Part; Datasheet: https://atta.szlcsc.com/upload/public/pdf/source/20180502/C191859_5B846418F1FC4C14CCCE0409874E2ED6.pdf; Supplier: LCSC; Tolerance: ±20%; Rated Voltage: 50V; Ripple Current: 14mA@120Hz; φD: 4mm; L: 5.4mm; Lifetime @ Temp: 2000hrs@105℃; Operating Temperature: -40℃~+105℃
C19 = 0603B104K500NT: 容值:100nF;精度:±10%;额定电压:50V;材质(温度系数):X7R;; LCSC Part Name: 100nF ±10% 50V; Supplier Part: C30926; Manufacturer: FH(风华); Supplier Footprint: 0603; JLCPCB Part Class: Extended Part; Datasheet: https://atta.szlcsc.com/upload/public/pdf/source/20200305/C486355_26A10D38EF8C2A5C37091D0039909270.pdf; Supplier: LCSC; Tolerance: ±10%; Voltage Rated: 50V; Temperature Coefficient: X7R
C22 C23 = VEZ101M1CTR-0605: 容值:100uF;精度:±20%;额定电压:16V;纹波电流:-;等效串联电阻:-;; LCSC Part Name: 100uF ±20% 16V; Supplier Part: C249766; Manufacturer: lelon(立隆); Supplier Footprint: SMD,D6.3xL5.3mm; JLCPCB Part Class: 扩展库; Datasheet: https://atta.szlcsc.com/upload/public/pdf/source/20181120/C249784_89014CEAAF166358520D39DEDA814C8E.pdf; Supplier: LCSC; Tolerance: ±20%; Rated Voltage: 16V; φD: 6.3mm; L: 5.3mm; Lifetime @ Temp: 1000hrs@105℃; Operating Temperature: -45℃~+105℃
CN1 = DB2ERC-3.81-2P-GN: 连接器类型:板端/插座-闭口;结构:1x2P;间距:3.81mm;颜色:绿色;安装方式:弯针;排数:1;每排PIN数:2;额定电流:10A;额定电压:250V;工作温度范围:-40℃~+105℃;; LCSC Part Name: 3.81mm 1x2P 排数:1 每排P数:2; Supplier Part: C395684; Manufacturer: DORABO(地博电气); Supplier Footprint: 弯插,P=3.81mm; JLCPCB Part Class: 扩展库; Datasheet: https://atta.szlcsc.com/upload/public/pdf/source/20221115/4E217E7D538220F8720C137D6A05E519.pdf; Supplier: LCSC; Connector Type: 板端/插座-闭口; Structure: 1x2P; Pitch: 3.81mm; Color: 绿色; Mounting Style: 弯针; Number of Pins: 2P; Number of Rows: 1; Number of PINs Per Row: 2; Current Rating (Max): 10A; Voltage Rating (Max): 250V; Operating Temperature Range: -40℃~+105℃
L1 = SWPA4030S4R7MT: 直流电阻(DCR):78mΩ;精度:±20%;电感值:4.7uH;额定电流:2A;; LCSC Part Name: 4.7uH ±20%; Supplier Part: C57269; Manufacturer: Sunlord(顺络); Supplier Footprint: SMD; JLCPCB Part Class: 扩展库; Datasheet: https://atta.szlcsc.com/upload/public/pdf/source/20161024/1477287957557.pdf; Supplier: LCSC; DC Resistance (DCR): 78mΩ; Tolerance: ±20%; Height: 3mm; Width: 4mm; Rated Current: 2A; Length: 4mm
L2 = FXL0420-100-M: 电感值:10uH;精度:±20%;额定电流:1.6A;类型:一体成型电感;饱和电流(Isat):2.2A;; LCSC Part Name: 10uH ±20% 2.2A; Supplier Part: C177242; Manufacturer: cjiang(长江微电); Supplier Footprint: SMD,4.2x4.4mm; JLCPCB Part Class: Extended Part; Datasheet: https://atta.szlcsc.com/upload/public/pdf/source/20200117/C485363_A2440626DC7482D75DD0DD56D1883FBF.pdf; Supplier: LCSC; Tolerance: ±20%; Rated Current: 1.6A; Type: 一体成型电感; DC Resistance (DCR): 282mΩ; Saturation Current (Isat): 2.2A
R1 R2 = 0402WGF5101TCE: 阻值:5.1kΩ;精度:±1%;功率:62.5mW;温度系数:±100ppm/℃;电阻类型:厚膜电阻;; LCSC Part Name: 5.1kΩ ±1% 62.5mW 厚膜电阻; Supplier Part: C25905; Manufacturer: UNI-ROYAL(厚声); Supplier Footprint: 0402; JLCPCB Part Class: Basic Part; Datasheet: https://atta.szlcsc.com/upload/public/pdf/source/20200306/C422600_1E6D84923E4A46A82E41ADD87F860B5C.pdf; Supplier: LCSC; Tolerance: ±1%; Power(Watts): 62.5mW; Overload Voltage (Max): 50V; Temperature Coefficient: ±100ppm/℃; Type: 厚膜电阻; Operating Temperature Range: -55℃~+155℃
R12 = 0402WGF6802TCE: 阻值:68kΩ;精度:±1%;功率:62.5mW;温度系数:±100ppm/℃;电阻类型:厚膜电阻;; LCSC Part Name: 68kΩ ±1% 62.5mW 厚膜电阻; Supplier Part: C36871; Manufacturer: UNI-ROYAL(厚声); Supplier Footprint: 0402; JLCPCB Part Class: Basic Part; Datasheet: https://atta.szlcsc.com/upload/public/pdf/source/20200306/C422600_1E6D84923E4A46A82E41ADD87F860B5C.pdf; Supplier: LCSC; Tolerance: ±1%; Power(Watts): 62.5mW; Overload Voltage (Max): 50V; Temperature Coefficient: ±100ppm/℃; Type: 厚膜电阻; Operating Temperature Range: -55℃~+155℃
R13 = 0402WGF1502TCE: 阻值:15kΩ;精度:±1%;功率:62.5mW;温度系数:±100ppm/℃;电阻类型:厚膜电阻;; LCSC Part Name: 15kΩ ±1% 62.5mW 厚膜电阻; Supplier Part: C25756; Manufacturer: UNI-ROYAL(厚声); Supplier Footprint: 0402; JLCPCB Part Class: Basic Part; Datasheet: https://atta.szlcsc.com/upload/public/pdf/source/20200306/C422600_1E6D84923E4A46A82E41ADD87F860B5C.pdf; Supplier: LCSC; Tolerance: ±1%; Power(Watts): 62.5mW; Overload Voltage (Max): 50V; Temperature Coefficient: ±100ppm/℃; Type: 厚膜电阻; Operating Temperature Range: -55℃~+155℃
R18 = RC0402FR-07100KL: 电阻类型:厚膜电阻;阻值:100kΩ;精度:±1%;功率:62.5mW;; LCSC Part Name: 100kΩ ±1% 62.5mW; Supplier Part: C60491; Manufacturer: YAGEO(国巨); Supplier Footprint: 0402; JLCPCB Part Class: Extended Part; Datasheet: https://atta.szlcsc.com/upload/public/pdf/source/20170518/1495086055123.pdf; Supplier: LCSC; Type: 厚膜电阻; Tolerance: ±1%; Power(Watts): 62.5mW; Temperature Coefficient: ±100ppm/℃; Overload Voltage (Max): 50V; Operating Temperature Range: -55℃~+155℃
R19 = AC0402DR-0710K7L: 电阻类型:厚膜电阻;阻值:10.7kΩ;精度:±0.5%;功率:62.5mW;最大工作电压:50V;温度系数:±100ppm/℃;; LCSC Part Name: 厚膜电阻 10.7kΩ ±0.5% 62.5mW; Supplier Part: C226678; Manufacturer: YAGEO(国巨); Supplier Footprint: 0402; JLCPCB Part Class: Extended Part; Datasheet: https://atta.szlcsc.com/upload/public/pdf/source/20190301/C230000_FEACA6AA45ADCA89EA12E4E744ACE6F2.pdf; Supplier: LCSC; Type: 厚膜电阻; Tolerance: ±0.5%; Power(Watts): 62.5mW; Overload Voltage (Max): 50V; Temperature Coefficient: ±100ppm/℃; Operating Temperature Range: -55℃~+155℃
R20 = 0402WGF5602TCE: 电阻类型:厚膜电阻;阻值:56kΩ;精度:±1%;功率:62.5mW;最大工作电压:50V;温度系数:±100ppm/℃;; LCSC Part Name: 56kΩ ±1% 62.5mW 厚膜电阻; Supplier Part: C25796; Manufacturer: UNI-ROYAL(厚声); Supplier Footprint: 0402; JLCPCB Part Class: 扩展库; Datasheet: https://atta.szlcsc.com/upload/public/pdf/source/20200306/C422600_1E6D84923E4A46A82E41ADD87F860B5C.pdf; Supplier: LCSC; Type: 厚膜电阻; Tolerance: ±1%; Power(Watts): 62.5mW; Overload Voltage (Max): 50V; Temperature Coefficient: ±100ppm/℃; Operating Temperature Range: -55℃~+155℃
U3 = SY8089AAAC: 功能类型:降压型;同步整流:-;输出通道数:-;拓扑结构:-;输入电压:-;输出电流(最大值):-;开关频率:-;; LCSC Part Name: 降压型; Supplier Part: C78988; Manufacturer: silergy(矽力杰); Supplier Footprint: SOT-23-5; JLCPCB Part Class: 扩展库; Datasheet: https://atta.szlcsc.com/upload/public/pdf/source/20210826/394049C81A2AF57A190C26FDBC282657.pdf; Supplier: LCSC; Function: 降压型
U4 = CH340N: LCSC Part Name: USB转串口芯片 CH340; Supplier Part: C2977777; Manufacturer: WCH(南京沁恒); Supplier Footprint: SOP-8; JLCPCB Part Class: 扩展库; Datasheet: https://atta.szlcsc.com/upload/public/pdf/source/20230530/6E401E9554E9F5311886CC8B3F89B62E.pdf; Supplier: LCSC
U5 = LGS5148: 功能类型:降压型;输出类型:可调;输入电压:4.5V~48V;输出电压:800mV~48V;输出电流(最大值):600mA;; LCSC Part Name: 降压型 Vin=4.5V~48V Vout=800mV~48V 600mA; Supplier Part: C5123972; Manufacturer: Legend-Si(棱晶半导体); Supplier Footprint: SOT-23-6; JLCPCB Part Class: Extended Part; Datasheet: https://atta.szlcsc.com/upload/public/pdf/source/20220808/A04A69C84DBF9BD2B84E9EA2B19AC21D.pdf; Supplier: LCSC; Function: 降压型; Synchronous Rectification: 是; Output Type: 可调; Number of Outputs: 1; Topology: 降压式; Input Voltage: 4.5V~48V; Output Voltage: 800mV~48V; Output Current (Max): 600mA; Switching Frequency: 900kHz; Quiescent Current (Iq): 200uA; Operating Temperature: -40℃~+125℃@(TJ)
USB1 = TYPE-C 16PIN 2MD(073): 连接器类型:Type-C;标准:-;公母:母;端口数量:1;触点数量:16P;安装方式:卧贴;额定电流 - 电源:5A;工作温度范围:-25℃~+85℃;; LCSC Part Name: Type-C 母 卧贴 带定位柱 不锈钢外壳 2次模顶; Supplier Part: C2765186; Manufacturer: SHOU HAN(首韩); Supplier Footprint: SMD; JLCPCB Part Class: 扩展库; Datasheet: https://atta.szlcsc.com/upload/public/pdf/source/20211123/39B17C16241EAC15C5E277BDA434118E.pdf; Supplier: LCSC; Connector Type: Type-C; Gender: 母; Number of Ports: 1; Number of Contacts: 16P; Mounting Style: 卧贴; Current Rating - Power (Max): 5A; Operating Temperature Range: -25℃~+85℃
USB2 = U-USBAR04P-F002: 连接器类型:Type-A;标准:USB 2.0;公母:母;端口数量:1;触点数量:4P;安装方式:弯插;额定电流 - 电源:1.5A;工作温度范围:0℃~+50℃;; LCSC Part Name: Type-A 母 弯插; Supplier Part: C386736; Manufacturer: Ckmtw(灿科盟); Supplier Footprint: 插件; JLCPCB Part Class: 扩展库; Datasheet: https://atta.szlcsc.com/upload/public/pdf/source/20190613/C386736_D4BE393BB14E5933BBD1B61F2FF851F7.pdf; Supplier: LCSC; Connector Type: Type-A; Standard: USB 2.0; Gender: 母; Number of Ports: 1; Number of Contacts: 4P; Mounting Style: 弯插; Current Rating - Power (Max): 1.5A; Operating Temperature Range: 0℃~+50℃

## Nets
3V3: C16.2 C17.2 CN2.2 L1.2 R5.1 R6.1 R12.1 R14.1 R15.2 R23.1 RJ1.9(L+) RJ1.11(R+) RJ2.9(L+) RJ2.11(R+) U1.2(3.3VD) U1.3(3.3VD) U12.2
5V: C15.2 C20.1 C21.1 C22.1 C23.1 L2.2 R11.2 R20.2 U2.8(VCC) U3.4(IN) U4.5(VCC) USB1.2(VBUS) USB1.11(VBUS) USB2.1(VCC)
GND: BT1.2 C1.2 C2.2 C9.1 C15.1 C16.1 C17.1 C18.2 C19.1 C20.2 C21.2 C22.2 C23.2 C24.1 C25.2 C26.1 C28.1 C29.1 C30.1 C31.1 C32.1 CN2.1 CN2.7 CN3.1 D1.2(-) R1.2 R2.2 R13.2 R19.1 RJ1.13(S) RJ1.14(S) RJ2.13(S) RJ2.14(S) SW1.2 SW1.3 SW1.4 U1.1(GND) U1.4(GND) U1.21(GND) U1.23(GND) U1.56(GND) U1.57(GND) U1.58(GND) U1.59(GND) U2.4(GND) U3.2(GND) U4.3(GND) U5.2(GND) U7.5(RTN) U7.8(WAD) U12.1 USB1.1(GND) USB1.12(GND) USB1.13(SHELL) USB1.14(SHELL) USB2.4(GND) USB2.5(SH1) USB2.6(SH2)
GND_POE: D2.2(-) D3.2(-) D4.2(-) D5.2(-) U7.4(VSS) U9.1
VIN: C18.1 C19.2 D1.1(+) D2.1(+) D3.1(+) D4.1(+) D5.1(+) R7.1 R8.2 R9.2 R18.2 U5.5(VIN) U7.1(VDD)
CONSOLE-RX: R3.1 U1.32(UART_RXD0)
CONSOLE-TX: R4.1 U1.31(UART_TXD0)
DEBUG-RX: R4.2 U4.7(RXD)
DEBUG-TX: R3.2 U4.6(TXD)
DM-UP: U4.2(UD-) USB1.5(DN2) USB1.7(DN1)
DP-UP: U4.1(UD+) USB1.6(DP1) USB1.8(DP2)
ETH-LED0: R21.2 U1.13(EPHY_LED0)
ETH-LED1: R22.2 U1.12(EPHY_LED1)
ETH-LED2: U1.11(EPHY_LED2)
ETH-LED3: U1.10(EPHY_LED3)
ETH-LED4: U1.9(EPHY_LED4)
ETH-RN0: U1.35(MDI_RN_P0) U6.6(TD2-)
ETH-RN1: U1.41(MDI_RN_P1) U8.6(TD2-)
ETH-RN2: U1.43(MDI_RN_P2)
ETH-RN3: U1.49(MDI_RN_P3)
ETH-RN4: U1.51(MDI_RN_P4)
ETH-RP0: U1.34(MDI_RP_P0) U6.5(TD2+)
ETH-RP1: U1.40(MDI_RP_P1) U8.5(TD2+)
ETH-RP2: U1.42(MDI_RP_P2)
ETH-RP3: U1.48(MDI_RP_P3)
ETH-RP4: U1.50(MDI_RP_P4)
ETH-TN0: U1.37(MDI_TN_P0) U6.3(TD1-)
ETH-TN1: U1.39(MDI_TN_P1) U8.3(TD1-)
ETH-TN2: U1.45(MDI_TN_P2)
ETH-TN3: U1.47(MDI_TN_P3)
ETH-TN4: U1.53(MDI_TN_P4)
ETH-TP0: U1.36(MDI_TP_P0) U6.2(TD1+)
ETH-TP1: U1.38(MDI_TP_P1) U8.2(TD1+)
ETH-TP2: U1.44(MDI_TP_P2)
ETH-TP3: U1.46(MDI_TP_P3)
ETH-TP4: U1.52(MDI_TP_P4)
GPIO0: CN2.12 U1.30(GPIO0)
I2C-SCK: CN2.3 R5.2 U1.24(I2C_SCLK) U2.6(SCL) U12.3
I2C-SDA: CN2.4 R6.2 U1.25(I2C_SD) U2.5(SDA) U12.4
I2S-CLK: U1.20(I2S_CLK) U12.8
I2S-SDI: U1.17(I2S_SDI) U12.5
I2S-SDO: U1.18(I2S_SDO) U12.6
I2S-WS: U1.19(I2S_WS) U12.7
KEY-RESTART: C26.2 R14.2 SW1.1 U1.8(WDT_RST_N)
PHY0_LED: R21.1 RJ1.10(L-) RJ1.12(R-)
PHY0_MDI0: D2.3(C2) U6.24(MCT1)
PHY0_MDI1: D2.4(C1) U6.21(MCT2)
PHY0_MDI2: D3.3(C2) U6.18(MCT3)
PHY0_MDI3: D3.4(C1) U6.15(MCT4)
PHY1_LED: R22.1 RJ2.10(L-) RJ2.12(R-)
PHY1_MDI0: D4.3(C2) U8.24(MCT1)
PHY1_MDI1: D4.4(C1) U8.21(MCT2)
PHY1_MDI2: D5.3(C2) U8.18(MCT3)
PHY1_MDI3: D5.4(C1) U8.15(MCT4)
REFCLK: CN3.2 U1.6(REF_CLK0)
SPI-CLK: CN2.10 U1.27(SPI_CLK)
SPI-CS1: CN2.11 U1.26(SPI_CS1)
SPI-MISO: CN2.9 U1.28(SPI_MISO)
SPI-MOSI: CN2.8 U1.29(SPI_MOSI)
SYS-LED: LED1.1(K) U1.33(WLED_N)
UART1-RX: CN2.6 R23.2 U1.16(UART_RXD1)
UART1-TX: CN2.5 U1.15(UART_TXD1)
USB_DM: U1.55(USB_DM) USB2.2(D-)
USB_DP: U1.54(USB_DP) USB2.3(D+)
$1N1673: LED1.2(A) R15.1
$2N388: L1.1 U3.3(LX)
$2N391: R11.1 U3.1(EN)
$2N396: R12.2 R13.1 U3.5(FB)
$2N582: R1.1 USB1.10(CC2)
$2N583: R2.1 USB1.4(CC1)
$2N928: C24.2 C25.1 U4.8(V3)
$2N1878: C27.2 U5.1(BST)
$2N1881: R18.1 U5.4(EN)
$2N1882: C27.1 L2.1 U5.6(SW)
$2N1886: R19.2 R20.1 U5.3(FB)
$2N2880: CN1.2 D1.3(C2)
$2N2893: CN1.1 D1.4(C1)
$3N214: BT1.1 U2.3(VBAT)
$3N217: C2.1 U2.1(X1) X1.2(OSC2)
$3N218: C1.1 U2.2(X2) X1.1(OSC1)
$5N391: RJ1.1 U6.23(MX1+)
$5N392: RJ1.2 U6.22(MX1-)
$5N393: RJ1.3 U6.20(MX2+)
$5N394: RJ1.6 U6.19(MX2-)
$5N395: RJ1.4 U6.17(MXT3+)
$5N396: RJ1.5 U6.16(MXT3-)
$5N397: RJ1.7 U6.14(MX4+)
$5N398: RJ1.8 U6.13(MX4-)
$5N662: RJ2.1 U8.23(MX1+)
$5N663: RJ2.2 U8.22(MX1-)
$5N664: RJ2.3 U8.20(MX2+)
$5N665: RJ2.6 U8.19(MX2-)
$5N666: RJ2.4 U8.17(MXT3+)
$5N667: RJ2.5 U8.16(MXT3-)
$5N668: RJ2.7 U8.14(MX4+)
$5N669: RJ2.8 U8.13(MX4-)
$5N1324: R7.2 U7.2(DET)
$5N1325: R8.1 U7.7(T2P)
$5N1326: R9.1 U7.6(PG)
$5N1328: U7.3(CLS) U9.2
$5N3561: C9.2 C28.2 C29.2 C30.2 C31.2 C32.2 U6.1(TCT1) U6.4(TCT2) U8.1(TCT1) U8.4(TCT2)

Not connected (* = marked no-connect by the designer): U1 5(SPI_CS0)* 7(PERST_N)* 14(PORST_N)* 22(ANT)*; U2 7(SQW/OUT)*; U4 4(RTS#)*; U6 7(TCT3)* 8(TD2+)* 9(TD3-)* 10(TCT4)* 11(TD4+)* 12(TD4-)*; U8 7(TCT3)* 8(TD2+)* 9(TD3-)* 10(TCT4)* 11(TD4+)* 12(TD4-)*; USB1 3(SBU2)* 9(SBU1)*
